# Altium project MidBoard.PrjPCB
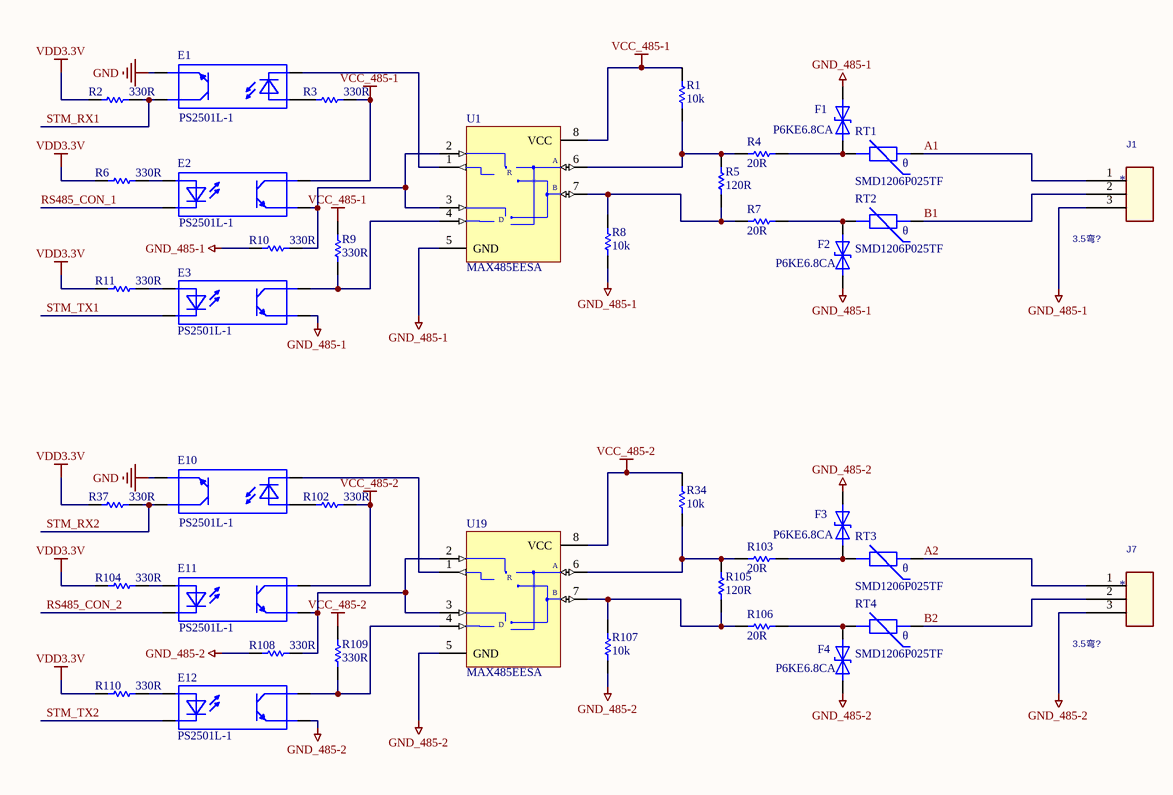
[diagram p0: Mid485.SchDoc]
10 sheets, 315 parts. Net scope: global (net labels, ports and power ports of the same name join across sheets).
Board file: MidBoard.PcbDoc
Sheets:
  Mid485.SchDoc
  MidAdc.SchDoc
  MidDac.SchDoc
  MidDin.SchDoc
  MidDout.SchDoc
  MidPower.SchDoc
  STM_MCU.SchDoc
  MidEthernet.SchDoc
  MidPwm.SchDoc
  MidWifi.SchDoc

## Sheet Mid485.SchDoc
size A4

### Parts
E1  PS2501L-1  [NEC2501]
E2  PS2501L-1  [NEC2501]
E3  PS2501L-1  [NEC2501]
E10  PS2501L-1  [NEC2501]
E11  PS2501L-1  [NEC2501]
E12  PS2501L-1  [NEC2501]
F1  P6KE6.8CA  [P6KE6,8CA]
F2  P6KE6.8CA  [P6KE6,8CA]
F3  P6KE6.8CA  [P6KE6,8CA]
F4  P6KE6.8CA  [P6KE6,8CA]
J1  *  [3.5-P3]
J7  *  [3.5-P3]
R1  value 10k  [0805]  (hidden comment: Res Semi)
R2  value 330R  [0805]  (hidden comment: Res Semi)
R3  value 330R  [0805]  (hidden comment: Res Semi)
R4  value 20R  [0805]  (hidden comment: Res Semi)
R5  value 120R  [0805]  (hidden comment: Res Semi)
R6  value 330R  [0805]  (hidden comment: Res Semi)
R7  value 20R  [0805]  (hidden comment: Res Semi)
R8  value 10k  [0805]  (hidden comment: Res Semi)
R9  value 330R  [0805]  (hidden comment: Res Semi)
R10  value 330R  [0805]  (hidden comment: Res Semi)
R11  value 330R  [0805]  (hidden comment: Res Semi)
R34  value 10k  [0805]  (hidden comment: Res Semi)
R37  value 330R  [0805]  (hidden comment: Res Semi)
R102  value 330R  [0805]  (hidden comment: Res Semi)
R103  value 20R  [0805]  (hidden comment: Res Semi)
R104  value 330R  [0805]  (hidden comment: Res Semi)
R105  value 120R  [0805]  (hidden comment: Res Semi)
R106  value 20R  [0805]  (hidden comment: Res Semi)
R107  value 10k  [0805]  (hidden comment: Res Semi)
R108  value 330R  [0805]  (hidden comment: Res Semi)
R109  value 330R  [0805]  (hidden comment: Res Semi)
R110  value 330R  [0805]  (hidden comment: Res Semi)
RT1  SMD1206P025TF  [1206]
RT2  SMD1206P025TF  [1206]
RT3  SMD1206P025TF  [1206]
RT4  SMD1206P025TF  [1206]
U1  MAX485EESA  [NSO8]
U19  MAX485EESA  [NSO8]

### Nets
GND: E1.3 E10.3
GND_485-1: E3.3 F1.1 F2.2 J1.3 R8.2 R10.2 U1.5(GND)
GND_485-2: E12.3 F3.1 F4.2 J7.3 R107.2 R108.2 U19.5(GND)
VCC_485-1: E2.4 R1.1 R3.1 R9.1 U1.8(VCC)
VCC_485-2: E11.4 R34.1 R102.1 R109.1 U19.8(VCC)
VDD3.3V: R2.2 R6.2 R11.2 R37.2 R104.2 R110.2
A1: J1.1 RT1.2
A2: J7.1 RT3.2
B1: J1.2 RT2.2
B2: J7.2 RT4.2
RS485_CON_1: E2.2
RS485_CON_2: E11.2
STM_RX1: E1.4 R2.1
STM_RX2: E10.4 R37.1
STM_TX1: E3.2
STM_TX2: E12.2
NetE1_1: E1.1 R3.2
NetE1_2: E1.2 U1.1(RO)
NetE2_1: E2.1 R6.1
NetE2_3: E2.3 R10.1 U1.2(~{RE}) U1.3(DE)
NetE3_1: E3.1 R11.1
NetE3_4: E3.4 R9.2 U1.4(DI)
NetE10_1: E10.1 R102.2
NetE10_2: E10.2 U19.1(RO)
NetE11_1: E11.1 R104.1
NetE11_3: E11.3 R108.1 U19.2(~{RE}) U19.3(DE)
NetE12_1: E12.1 R110.1
NetE12_4: E12.4 R109.2 U19.4(DI)
NetF1_2: F1.2 R4.2 RT1.1
NetF2_1: F2.1 R7.2 RT2.1
NetF3_2: F3.2 R103.2 RT3.1
NetF4_1: F4.1 R106.2 RT4.1
NetR1_2: R1.2 R4.1 R5.1 U1.6(A)
NetR5_2: R5.2 R7.1 R8.1 U1.7(B)
NetR34_2: R34.2 R103.1 R105.1 U19.6(A)
NetR105_2: R105.2 R106.1 R107.1 U19.7(B)

### Notes on the sheet
- (in symbol CON3) 3.5弯?
- (in symbol MAX485ESA) R; D
- (in symbol PTC) θ

### Library data of the parts
E1-E3 E10-E12 = OPT: 光耦
F1-F4 = TVS: 快速瞬变二极管
J1 J7 = CON3: TOLERANCE: =J65_TOLERANCE
R1-R11 R34 R37 R102-R110 = Res Semi: Semiconductor Resistor; Published: 8-Jun-2000; LatestRevisionDate: 17-Jul-2002; LatestRevisionNote: Re-released for DXP Platform.; PackageReference: AXIAL-0.5; Publisher: Altium Limited
RT1-RT4 = PTC: 热敏电阻
U1 U19 = MAX485ESA: Low-Power, Slew-Rate-Limited RS-485/RS-422 Transceiver; Code - JEDEC: MS-012-AA; Code - IPC: SO8; Published: 16-Jan-2001; Revision: 17-Jul-2002: Re-released for DXP Platform.; Datasheet: Latest Revision: Feb-1996; Package Reference: NSO8; Publisher: Altium Limited

## Sheet MidAdc.SchDoc
size A4
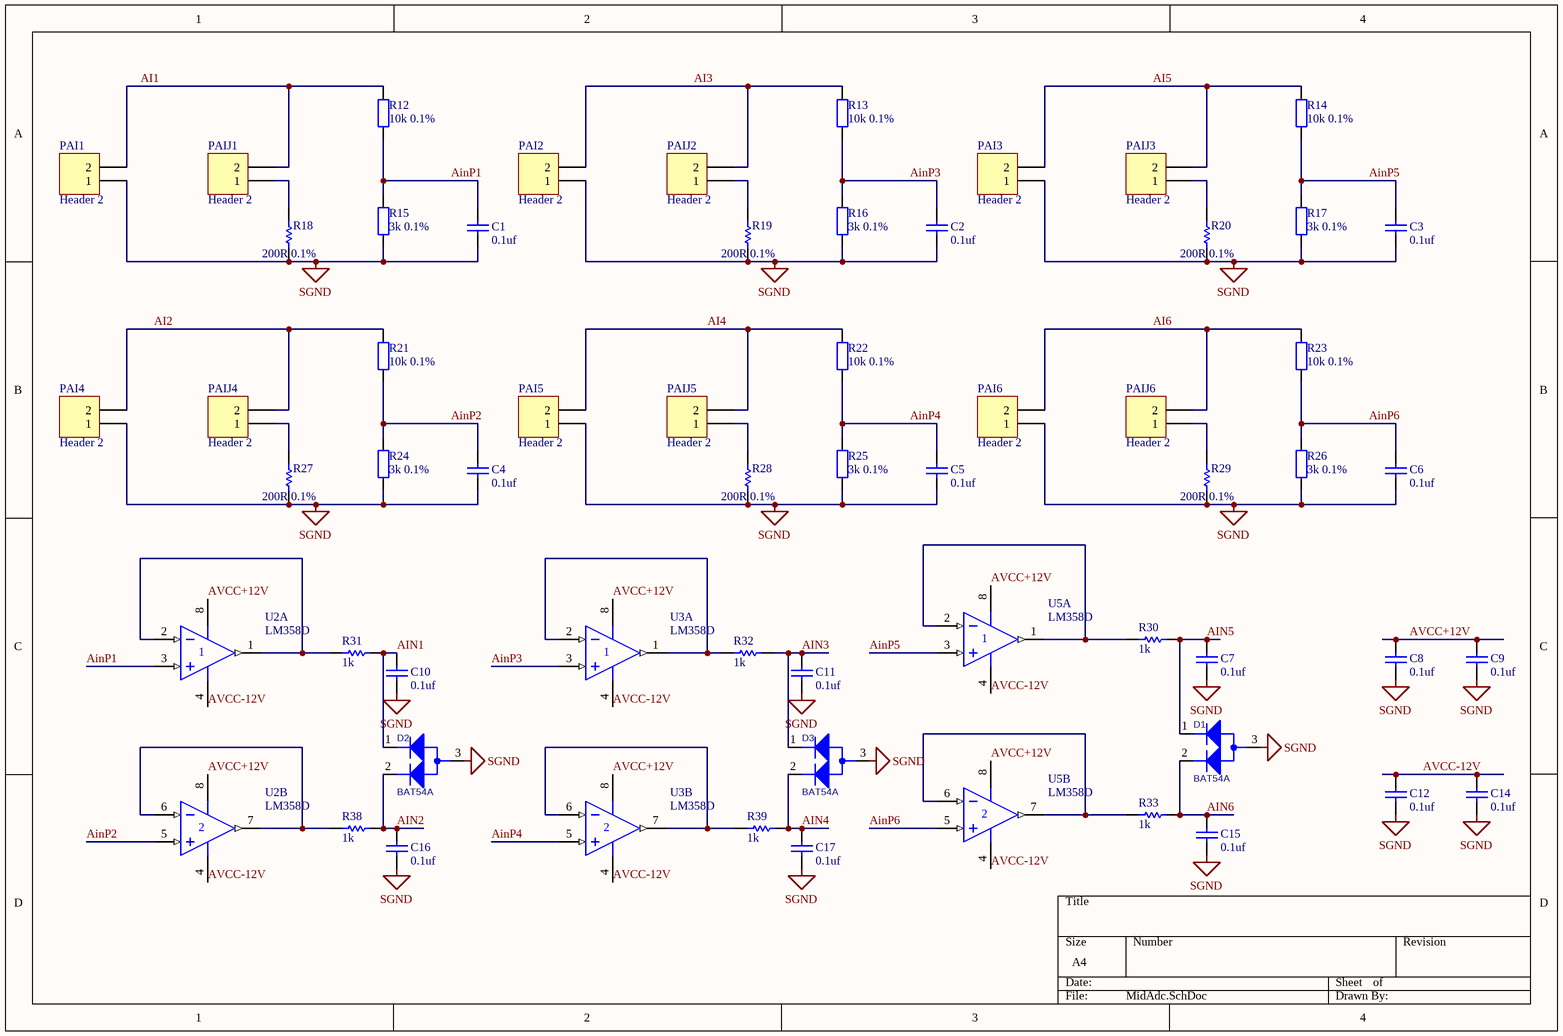
[diagram p1: MidAdc.SchDoc]

### Parts
C1  value 0.1uf  [C0805]  (hidden comment: Cap)
C2  value 0.1uf  [C0805]  (hidden comment: Cap)
C3  value 0.1uf  [C0805]  (hidden comment: Cap)
C4  value 0.1uf  [C0805]  (hidden comment: Cap)
C5  value 0.1uf  [C0805]  (hidden comment: Cap)
C6  value 0.1uf  [C0805]  (hidden comment: Cap)
C7  value 0.1uf  [C0805]  (hidden comment: Cap)
C8  value 0.1uf  [C0805]  (hidden comment: Cap)
C9  value 0.1uf  [C0805]  (hidden comment: Cap)
C10  value 0.1uf  [C0805]  (hidden comment: Cap)
C11  value 0.1uf  [C0805]  (hidden comment: Cap)
C12  value 0.1uf  [C0805]  (hidden comment: Cap)
C14  value 0.1uf  [C0805]  (hidden comment: Cap)
C15  value 0.1uf  [C0805]  (hidden comment: Cap)
C16  value 0.1uf  [C0805]  (hidden comment: Cap)
C17  value 0.1uf  [C0805]  (hidden comment: Cap)
D1  BAT54A  [SOT23]
D2  BAT54A  [SOT23]
D3  BAT54A  [SOT23]
PAI1  Header 2  [3.5-P2]
PAI2  Header 2  [3.5-P2]
PAI3  Header 2  [3.5-P2]
PAI4  Header 2  [3.5-P2]
PAI5  Header 2  [3.5-P2]
PAI6  Header 2  [3.5-P2]
PAIJ1  Header 2  [HDR1X2]
PAIJ2  Header 2  [HDR1X2]
PAIJ3  Header 2  [HDR1X2]
PAIJ4  Header 2  [HDR1X2]
PAIJ5  Header 2  [HDR1X2]
PAIJ6  Header 2  [HDR1X2]
R12  value 10k 0.1%  [0805]  (hidden comment: Res2)
R13  value 10k 0.1%  [0805]  (hidden comment: Res2)
R14  value 10k 0.1%  [0805]  (hidden comment: Res2)
R15  value 3k 0.1%  [0805]  (hidden comment: Res2)
R16  value 3k 0.1%  [0805]  (hidden comment: Res2)
R17  value 3k 0.1%  [0805]  (hidden comment: Res2)
R18  value 200R 0.1%  [0805]  (hidden comment: Res Semi)
R19  value 200R 0.1%  [0805]  (hidden comment: Res Semi)
R20  value 200R 0.1%  [0805]  (hidden comment: Res Semi)
R21  value 10k 0.1%  [0805]  (hidden comment: Res2)
R22  value 10k 0.1%  [0805]  (hidden comment: Res2)
R23  value 10k 0.1%  [0805]  (hidden comment: Res2)
R24  value 3k 0.1%  [0805]  (hidden comment: Res2)
R25  value 3k 0.1%  [0805]  (hidden comment: Res2)
R26  value 3k 0.1%  [0805]  (hidden comment: Res2)
R27  value 200R 0.1%  [0805]  (hidden comment: Res Semi)
R28  value 200R 0.1%  [0805]  (hidden comment: Res Semi)
R29  value 200R 0.1%  [0805]  (hidden comment: Res Semi)
R30  value 1k  [0805]  (hidden comment: Res Semi)
R31  value 1k  [0805]  (hidden comment: Res Semi)
R32  value 1k  [0805]  (hidden comment: Res Semi)
R33  value 1k  [0805]  (hidden comment: Res Semi)
R38  value 1k  [0805]  (hidden comment: Res Semi)
R39  value 1k  [0805]  (hidden comment: Res Semi)
U2  LM358D  [751-02_N]  (parts A,B of 2)
U3  LM358D  [751-02_N]  (parts A,B of 2)
U5  LM358D  [751-02_N]  (parts A,B of 2)

### Nets
SGND: C1.2 C2.2 C3.2 C4.2 C5.2 C6.2 C7.2 C8.2 C9.2 C10.2 C11.2 C12.2 C14.2 C15.2 C16.2 C17.2 D1.3 D2.3 D3.3 PAI1.1 PAI2.1 PAI3.1 PAI4.1 PAI5.1 PAI6.1 R15.2 R16.2 R17.2 R18.2 R19.2 R20.2 R24.2 R25.2 R26.2 R27.2 R28.2 R29.2  [project net ASSA]
AI1: PAI1.2 PAIJ1.2 R12.1
AI2: PAI4.2 PAIJ4.2 R21.1
AI3: PAI2.2 PAIJ2.2 R13.1
AI4: PAI5.2 PAIJ5.2 R22.1
AI5: PAI3.2 PAIJ3.2 R14.1
AI6: PAI6.2 PAIJ6.2 R23.1
AIN1: C10.1 D2.1 R31.2
AIN2: C16.1 D2.2 R38.2
AIN3: C11.1 D3.1 R32.2
AIN4: C17.1 D3.2 R39.2
AIN5: C7.1 D1.1 R30.2
AIN6: C15.1 D1.2 R33.2
AinP1: C1.1 R12.2 R15.1 U2.3(IN+)
AinP2: C4.1 R21.2 R24.1 U2.5(IN+)
AinP3: C2.1 R13.2 R16.1 U3.3(IN+)
AinP4: C5.1 R22.2 R25.1 U3.5(IN+)
AinP5: C3.1 R14.2 R17.1 U5.3(IN+)
AinP6: C6.1 R23.2 R26.1 U5.5(IN+)
AVCC+12V: C8.1 C9.1 U2.8(V+) U3.8(V+) U5.8(V+)
AVCC-12V: C12.1 C14.1 U2.4(V-) U3.4(V-) U5.4(V-)
NetPAIJ1_1: PAIJ1.1 R18.1
NetPAIJ2_1: PAIJ2.1 R19.1
NetPAIJ3_1: PAIJ3.1 R20.1
NetPAIJ4_1: PAIJ4.1 R27.1
NetPAIJ5_1: PAIJ5.1 R28.1
NetPAIJ6_1: PAIJ6.1 R29.1
NetR30_1: R30.1 U5.1(OUT) U5.2(IN-)
NetR31_1: R31.1 U2.1(OUT) U2.2(IN-)
NetR32_1: R32.1 U3.1(OUT) U3.2(IN-)
NetR33_1: R33.1 U5.6(IN-) U5.7(OUT)
NetR38_1: R38.1 U2.6(IN-) U2.7(OUT)
NetR39_1: R39.1 U3.6(IN-) U3.7(OUT)

### Library data of the parts
C1-C12 C14-C17 = Cap: Capacitor; Manufacturer: Generic Components; Class: Passive; Published: 08/06/2000; Publisher: Altium Hobart Technology Centre; SubClass: Capacitor
D1-D3 = BAT54A/SOT_2: PCB Footprint SMD: SMD; SMT: Y; TOLERANCE: =D22_TOLERANCE
PAI1-PAI6 PAIJ1-PAIJ6 = Header 2: Header, 2-Pin; LatestRevisionDate: 17-Jul-2002; LatestRevisionNote: Re-released for DXP Platform.; Publisher: Altium Limited
R12-R17 R21-R26 = RES
R18-R20 R27-R33 R38 R39 = Res Semi: Semiconductor Resistor; Published: 8-Jun-2000; LatestRevisionDate: 17-Jul-2002; LatestRevisionNote: Re-released for DXP Platform.; PackageReference: AXIAL-0.5; Publisher: Altium Limited
U2 U3 U5 = LM358D: Dual Low-Power Operational Amplifier; Published: 17-Jul-2002; LatestRevisionDate: 13-Apr-2006; LatestRevisionNote: IPC-7351 Footprint Added.; DatasheetVersion: 1988; PackageReference: 751-02; Publisher: Altium Limited; PackageDescription: 8-Pin Small Outline Integrated Circuit 1.27 mm Pitch; Code_JEDEC: MS-012-AA; Code_IPC: SOIC127P600-8; ComponentLink1Description: Manufacturer Link; ComponentLink1URL: http://www.onsemi.com/site/products/parametrics/0,4446,251,00.html; ComponentLink2Description: Datasheet; ComponentLink2URL: http://www.onsemi.com/pub/Collateral/LM358-D.PDF

## Sheet MidDac.SchDoc
size A3
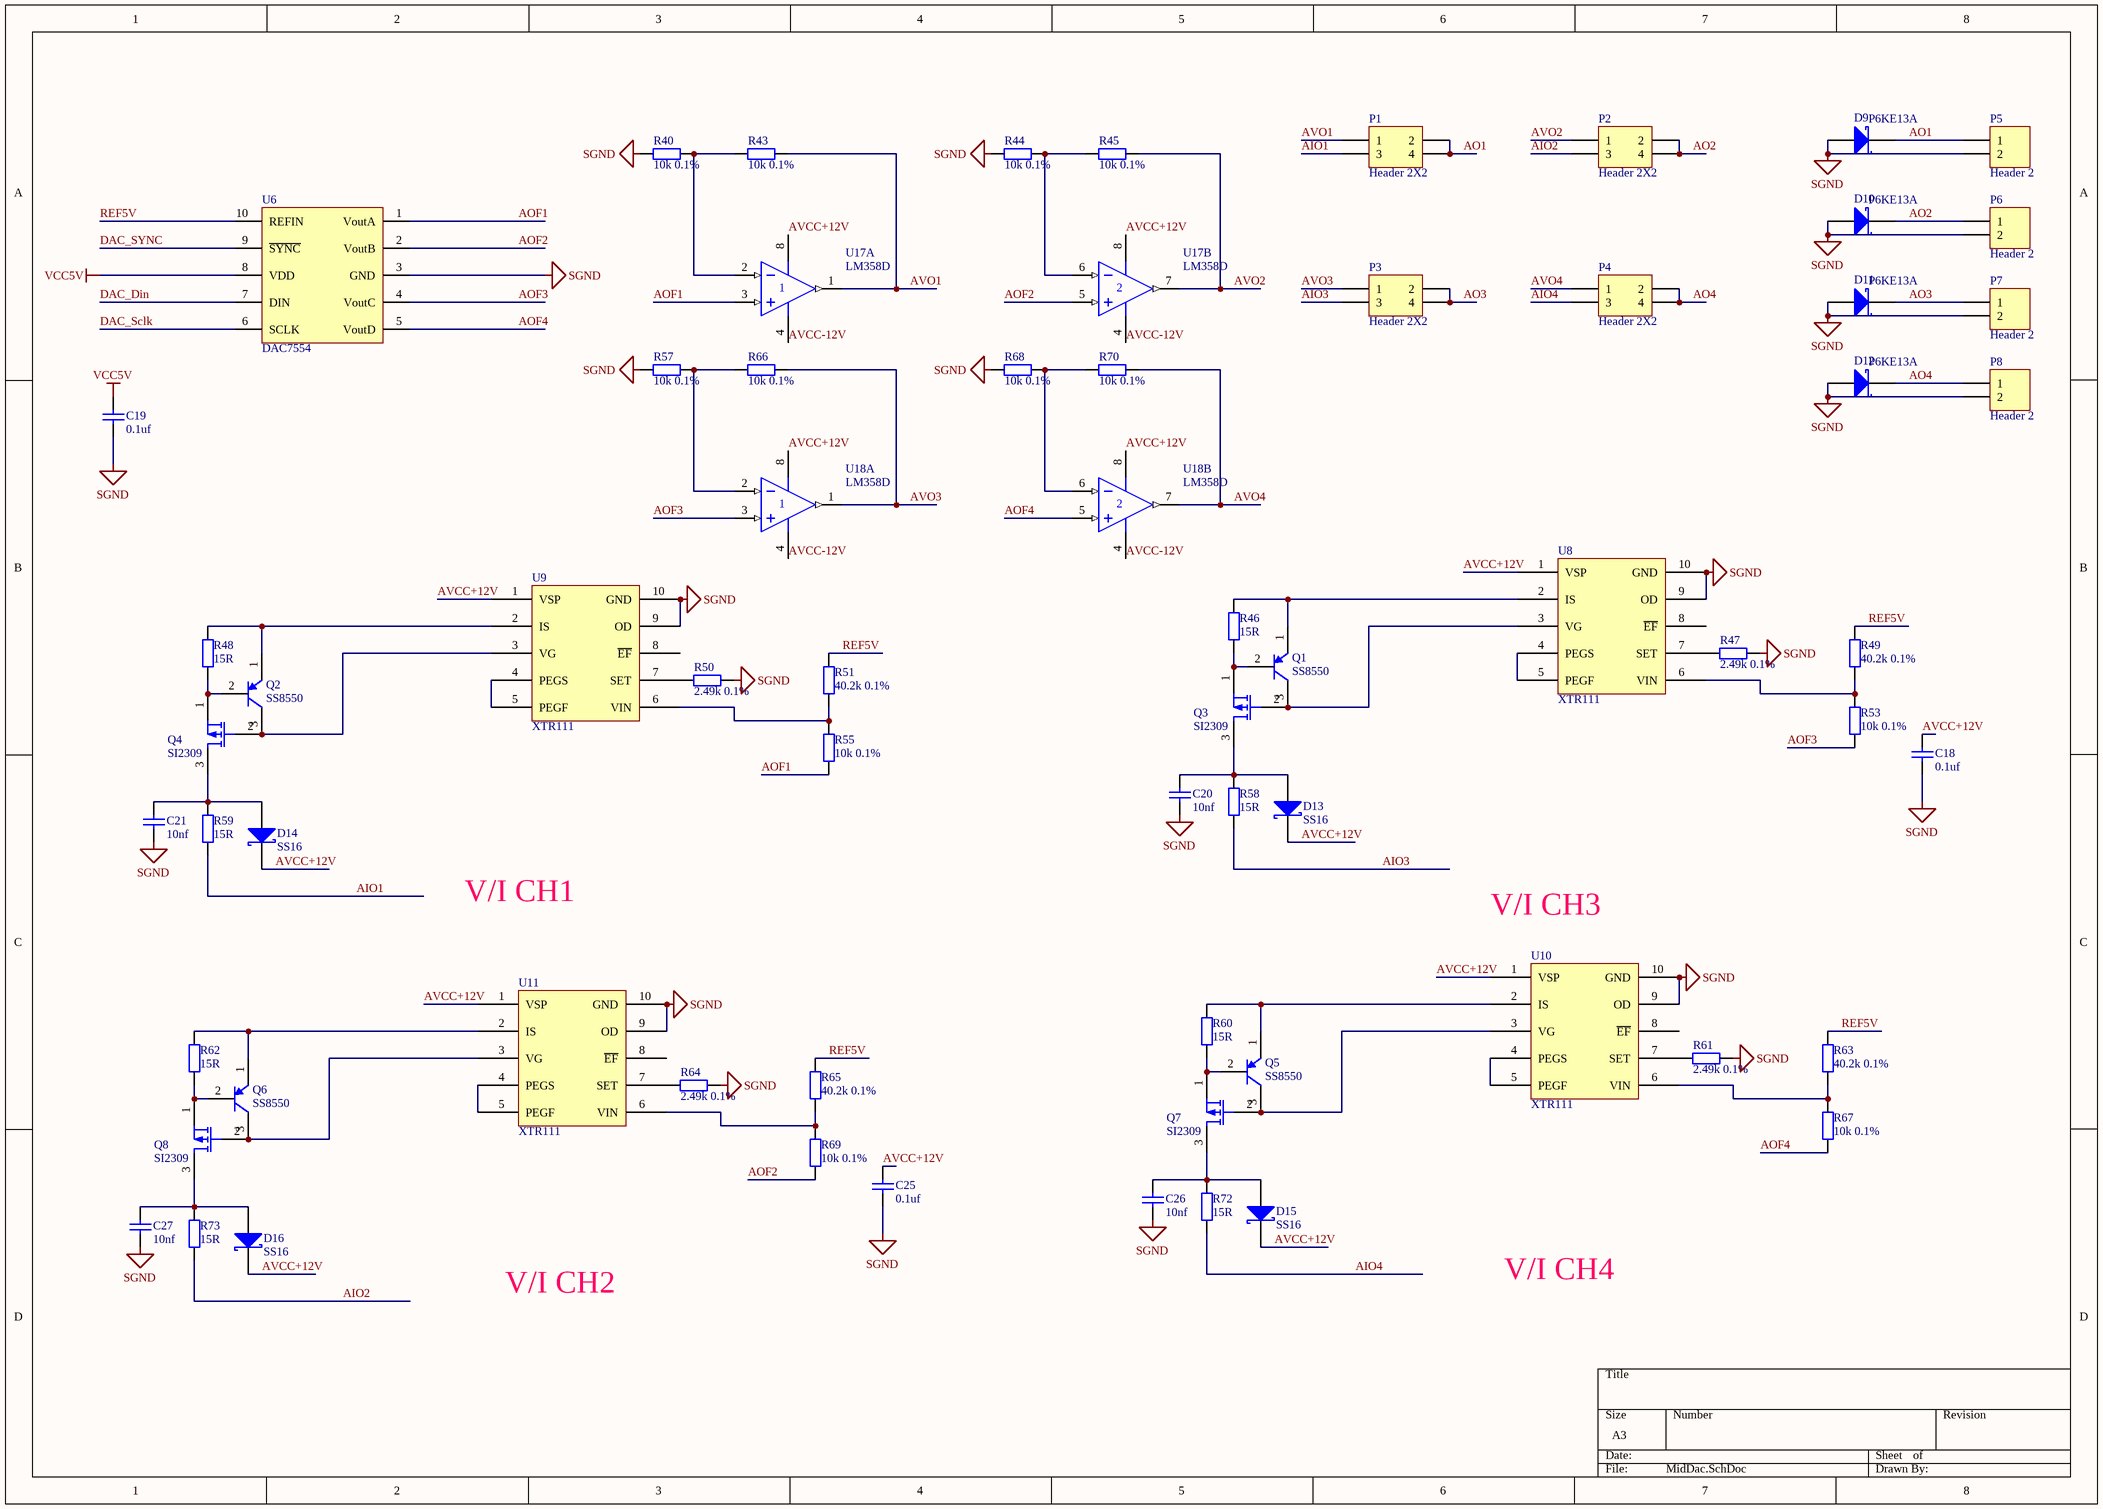
[diagram p2: MidDac.SchDoc]

### Parts
C18  value 0.1uf  [C0805]  (hidden comment: Cap)
C19  value 0.1uf  [C0805]  (hidden comment: Cap)
C20  value 10nf  [C0805]  (hidden comment: Cap)
C21  value 10nf  [C0805]  (hidden comment: Cap)
C25  value 0.1uf  [C0805]  (hidden comment: Cap)
C26  value 10nf  [C0805]  (hidden comment: Cap)
C27  value 10nf  [C0805]  (hidden comment: Cap)
D9  P6KE13A  [SMB]
D10  P6KE13A  [SMB]
D11  P6KE13A  [SMB]
D12  P6KE13A  [SMB]
D13  SS16  [SMB]
D14  SS16  [SMB]
D15  SS16  [SMB]
D16  SS16  [SMB]
P1  Header 2X2  [HDR2X2]
P2  Header 2X2  [HDR2X2]
P3  Header 2X2  [HDR2X2]
P4  Header 2X2  [HDR2X2]
P5  Header 2  [3.5-P2]
P6  Header 2  [3.5-P2]
P7  Header 2  [3.5-P2]
P8  Header 2  [3.5-P2]
Q1  SS8550  [sot-23]
Q2  SS8550  [sot-23]
Q3  SI2309  [sot-23]
Q4  SI2309  [sot-23]
Q5  SS8550  [sot-23]
Q6  SS8550  [sot-23]
Q7  SI2309  [sot-23]
Q8  SI2309  [sot-23]
R40  value 10k 0.1%  [0805]  (hidden comment: Res2)
R43  value 10k 0.1%  [0805]  (hidden comment: Res2)
R44  value 10k 0.1%  [0805]  (hidden comment: Res2)
R45  value 10k 0.1%  [0805]  (hidden comment: Res2)
R46  value 15R  [0805]  (hidden comment: Res2)
R47  value 2.49k 0.1%  [0805]  (hidden comment: Res2)
R48  value 15R  [0805]  (hidden comment: Res2)
R49  value 40.2k 0.1%  [0805]  (hidden comment: Res2)
R50  value 2.49k 0.1%  [0805]  (hidden comment: Res2)
R51  value 40.2k 0.1%  [0805]  (hidden comment: Res2)
R53  value 10k 0.1%  [0805]  (hidden comment: Res2)
R55  value 10k 0.1%  [0805]  (hidden comment: Res2)
R57  value 10k 0.1%  [0805]  (hidden comment: Res2)
R58  value 15R  [0805]  (hidden comment: Res2)
R59  value 15R  [0805]  (hidden comment: Res2)
R60  value 15R  [0805]  (hidden comment: Res2)
R61  value 2.49k 0.1%  [0805]  (hidden comment: Res2)
R62  value 15R  [0805]  (hidden comment: Res2)
R63  value 40.2k 0.1%  [0805]  (hidden comment: Res2)
R64  value 2.49k 0.1%  [0805]  (hidden comment: Res2)
R65  value 40.2k 0.1%  [0805]  (hidden comment: Res2)
R66  value 10k 0.1%  [0805]  (hidden comment: Res2)
R67  value 10k 0.1%  [0805]  (hidden comment: Res2)
R68  value 10k 0.1%  [0805]  (hidden comment: Res2)
R69  value 10k 0.1%  [0805]  (hidden comment: Res2)
R70  value 10k 0.1%  [0805]  (hidden comment: Res2)
R72  value 15R  [0805]  (hidden comment: Res2)
R73  value 15R  [0805]  (hidden comment: Res2)
U6  DAC7554  [VSSOP10]
U8  XTR111  [TSSOP-10_P]
U9  XTR111  [TSSOP-10_P]
U10  XTR111  [TSSOP-10_P]
U11  XTR111  [TSSOP-10_P]
U17  LM358D  [751-02_N]  (parts A,B of 2)
U18  LM358D  [751-02_N]  (parts A,B of 2)

### Nets
SGND: C18.2 C19.2 C20.2 C21.2 C25.2 C26.2 C27.2 D9.1(A) D10.1(A) D11.1(A) D12.1(A) P5.2 P6.2 P7.2 P8.2 R40.1 R44.1 R47.2 R50.2 R57.1 R61.2 R64.2 R68.1 U6.3(GND) U8.9(OD) U8.10(GND) U9.9(OD) U9.10(GND) U10.9(OD) U10.10(GND) U11.9(OD) U11.10(GND)  [project net ASSA]
VCC5V: C19.1 U6.8(VDD)
AIO1: P1.3 R59.2
AIO2: P2.3 R73.2
AIO3: P3.3 R58.2
AIO4: P4.3 R72.2
AO1: D9.2(K) P1.2 P1.4 P5.1
AO2: D10.2(K) P2.2 P2.4 P6.1
AO3: D11.2(K) P3.2 P3.4 P7.1
AO4: D12.2(K) P4.2 P4.4 P8.1
AOF1: R55.2 U6.1(VoutA) U17.3(IN+)
AOF2: R69.2 U6.2(VoutB) U17.5(IN+)
AOF3: R53.2 U6.4(VoutC) U18.3(IN+)
AOF4: R67.2 U6.5(VoutD) U18.5(IN+)
AVCC+12V: C18.1 C25.1 D13.2(K) D14.2(K) D15.2(K) D16.2(K) U8.1(VSP) U9.1(VSP) U10.1(VSP) U11.1(VSP) U17.8(V+) U18.8(V+)
AVCC-12V: U17.4(V-) U18.4(V-)
AVO1: P1.1 R43.2 U17.1(OUT)
AVO2: P2.1 R45.2 U17.7(OUT)
AVO3: P3.1 R66.2 U18.1(OUT)
AVO4: P4.1 R70.2 U18.7(OUT)
DAC_Din: U6.7(DIN)
DAC_Sclk: U6.6(SCLK)
DAC_SYNC: U6.9(~{SYNC})
REF5V: R49.1 R51.1 R63.1 R65.1 U6.10(REFIN)
NetC20_1: C20.1 D13.1(A) Q3.3(D) R58.1
NetC21_1: C21.1 D14.1(A) Q4.3(D) R59.1
NetC26_1: C26.1 D15.1(A) Q7.3(D) R72.1
NetC27_1: C27.1 D16.1(A) Q8.3(D) R73.1
NetQ1_1: Q1.1(E) R46.1 U8.2(IS)
NetQ1_2: Q1.2(B) Q3.1(S) R46.2
NetQ1_3: Q1.3(C) Q3.2(G) U8.3(VG)
NetQ2_1: Q2.1(E) R48.1 U9.2(IS)
NetQ2_2: Q2.2(B) Q4.1(S) R48.2
NetQ2_3: Q2.3(C) Q4.2(G) U9.3(VG)
NetQ5_1: Q5.1(E) R60.1 U10.2(IS)
NetQ5_2: Q5.2(B) Q7.1(S) R60.2
NetQ5_3: Q5.3(C) Q7.2(G) U10.3(VG)
NetQ6_1: Q6.1(E) R62.1 U11.2(IS)
NetQ6_2: Q6.2(B) Q8.1(S) R62.2
NetQ6_3: Q6.3(C) Q8.2(G) U11.3(VG)
NetR40_2: R40.2 R43.1 U17.2(IN-)
NetR44_2: R44.2 R45.1 U17.6(IN-)
NetR47_1: R47.1 U8.7(SET)
NetR49_2: R49.2 R53.1 U8.6(VIN)
NetR50_1: R50.1 U9.7(SET)
NetR51_2: R51.2 R55.1 U9.6(VIN)
NetR57_2: R57.2 R66.1 U18.2(IN-)
NetR61_1: R61.1 U10.7(SET)
NetR63_2: R63.2 R67.1 U10.6(VIN)
NetR64_1: R64.1 U11.7(SET)
NetR65_2: R65.2 R69.1 U11.6(VIN)
NetR68_2: R68.2 R70.1 U18.6(IN-)
NetU8_4: U8.4(PEGS) U8.5(PEGF)
NetU9_4: U9.4(PEGS) U9.5(PEGF)
NetU10_4: U10.4(PEGS) U10.5(PEGF)
NetU11_4: U11.4(PEGS) U11.5(PEGF)

Not connected (* = marked no-connect by the designer): U8 8(~{EF}); U9 8(~{EF}); U10 8(~{EF}); U11 8(~{EF})

### Notes on the sheet
- V/I CH1
- V/I CH3
- V/I CH2
- V/I CH4

### Library data of the parts
C18-C21 C25-C27 = Cap: as C1 on sheet MidAdc; Published: 08/06/2000; Publisher: Altium Hobart Technology Centre; SubClass: Capacitor
D9-D16 = D Schottky: Schottky Diode; Published: 8-Jun-2000; LatestRevisionDate: 17-Jul-2002; LatestRevisionNote: Re-released for DXP Platform.; PackageReference: SMB; Publisher: Altium Limited; Code_JEDEC: DO-214-AA
P1-P4 = Header 2X2: Header, 2-Pin, Dual row; LatestRevisionDate: 17-Jul-2002; LatestRevisionNote: Re-released for DXP Platform.; Publisher: Altium Limited
P5-P8 = Header 2: Header, 2-Pin; LatestRevisionDate: 17-Jul-2002; LatestRevisionNote: Re-released for DXP Platform.; Publisher: Altium Limited
Q1 Q2 Q5 Q6 = 2N3906: PNP General Purpose Amplifier; Published: 8-Jun-2000; LatestRevisionDate: 15-Jan-2003; LatestRevisionNote: PCB Footprint 'BCY-W3/D4.7' replaced; DatasheetVersion: 1997; PackageVersion: Sep-1998; PackageReference: TO-92A; Publisher: Altium Limited; PackageDescription: TO, Flat Index; 3 In-Line, Axial Leads; Body Dia. 4.5mm; Leads 0.51 x 0.48 mm (max); ComponentLink1Description: Manufacturer Link; ComponentLink1URL: http://www.fairchildsemi.com/; ComponentLink2Description: Datasheet; ComponentLink2URL: http://www.fairchildsemi.com/ds/2N%2F2N3906.pdf
Q3 Q4 Q7 Q8 = MOSFET-P: P-Channel MOSFET; Published: 8-Jun-2000; LatestRevisionDate: 17-Jul-2002; LatestRevisionNote: Re-released for DXP Platform.; PackageVersion: 1995/1996; PackageReference: E3; Publisher: Altium Limited; PackageDescription: TO, Flat Index; 3 In-Line, Axial Leads; Body Dia. 4.6mm; Lead Dia. 0.5 mm (max)
R40 R43-R51 R53 R55 R57-R70 R72 R73 = RES
U8-U11 = XT
U17 U18 = LM358D: Dual Low-Power Operational Amplifier; Published: 17-Jul-2002; LatestRevisionDate: 13-Apr-2006; LatestRevisionNote: IPC-7351 Footprint Added.; DatasheetVersion: 1988; PackageReference: 751-02; Publisher: Altium Limited; PackageDescription: 8-Pin Small Outline Integrated Circuit 1.27 mm Pitch; Code_JEDEC: MS-012-AA; Code_IPC: SOIC127P600-8; ComponentLink1Description: Manufacturer Link; ComponentLink1URL: http://www.onsemi.com/site/products/parametrics/0,4446,251,00.html; ComponentLink2Description: Datasheet; ComponentLink2URL: http://www.onsemi.com/pub/Collateral/LM358-D.PDF

## Sheet MidDin.SchDoc
size A4
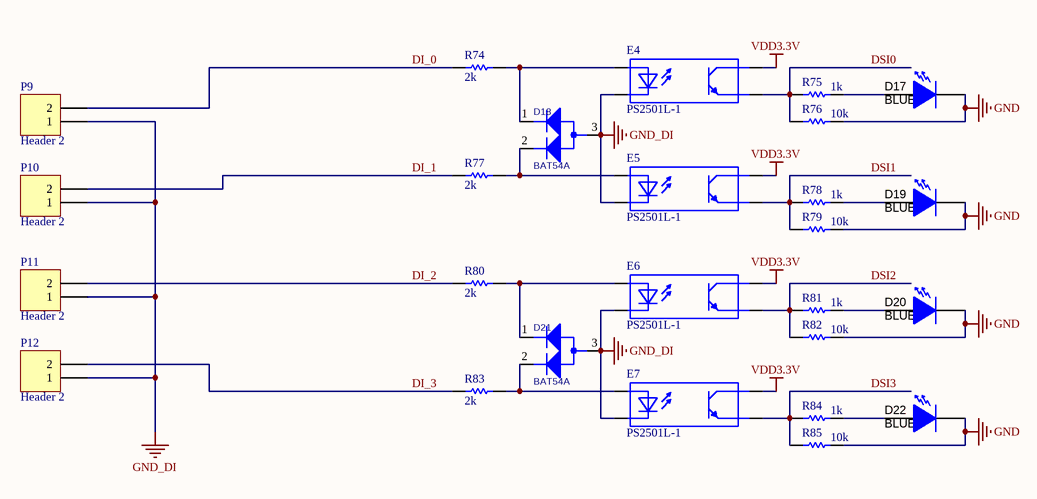
[diagram p3: MidDin.SchDoc]

### Parts
D17  value BLUE  [D0805]  (hidden comment: SML-P12YTT86)
D18  BAT54A  [SOT23]
D19  value BLUE  [D0805]  (hidden comment: SML-P12YTT86)
D20  value BLUE  [D0805]  (hidden comment: SML-P12YTT86)
D21  BAT54A  [SOT23]
D22  value BLUE  [D0805]  (hidden comment: SML-P12YTT86)
E4  PS2501L-1  [NEC2501]
E5  PS2501L-1  [NEC2501]
E6  PS2501L-1  [NEC2501]
E7  PS2501L-1  [NEC2501]
P9  Header 2  [3.5-P2]
P10  Header 2  [3.5-P2]
P11  Header 2  [3.5-P2]
P12  Header 2  [3.5-P2]
R74  value 2k  [0805]  (hidden comment: Res Semi)
R75  value 1k  [0805]  (hidden comment: Res Semi)
R76  value 10k  [0805]  (hidden comment: Res Semi)
R77  value 2k  [0805]  (hidden comment: Res Semi)
R78  value 1k  [0805]  (hidden comment: Res Semi)
R79  value 10k  [0805]  (hidden comment: Res Semi)
R80  value 2k  [0805]  (hidden comment: Res Semi)
R81  value 1k  [0805]  (hidden comment: Res Semi)
R82  value 10k  [0805]  (hidden comment: Res Semi)
R83  value 2k  [0805]  (hidden comment: Res Semi)
R84  value 1k  [0805]  (hidden comment: Res Semi)
R85  value 10k  [0805]  (hidden comment: Res Semi)

### Nets
GND: D17.2(K) D19.2(K) D20.2(K) D22.2(K) R76.2 R79.2 R82.2 R85.2
GND_DI: D18.3 D21.3 E4.2 E5.2 E6.2 E7.2 P9.1 P10.1 P11.1 P12.1
VDD3.3V: E4.4 E5.4 E6.4 E7.4
DI_0: P9.2 R74.1
DI_1: P10.2 R77.1
DI_2: P11.2 R80.1
DI_3: P12.2 R83.1
DSI0: E4.3 R75.1 R76.1
DSI1: E5.3 R78.1 R79.1
DSI2: E6.3 R81.1 R82.1
DSI3: E7.3 R84.1 R85.1
NetD17_1: D17.1(A) R75.2
NetD18_1: D18.1 E4.1 R74.2
NetD18_2: D18.2 E5.1 R77.2
NetD19_1: D19.1(A) R78.2
NetD20_1: D20.1(A) R81.2
NetD21_1: D21.1 E6.1 R80.2
NetD21_2: D21.2 E7.1 R83.2
NetD22_1: D22.1(A) R84.2

### Library data of the parts
D17 D19 D20 D22 = SML-P12YTT86: LED, GREEN SMD; Manufacturer: Rohm; Type: InGaN; Vf_V: 2.1; Value2: 2.1V; Io_A: 0.02; Tjmax_C: 85; Value1: W; Color: yellow; U/M: EA; CompType: LED; PartNumber: SML-P12YTT86; SymbolVersion: 2008-12-08; MountType: SMT; RoHS: Y; PackageReference: Yellow LED; Published: 2008-07-11; Publisher: Texas Instruments; ComponentLink1URL: http://rohmfs.rohm.com/en/products/databook/datasheet/opto/led/chip_mono/sml-p1.pdf; ComponentLink1Description: Datasheet link; LatestRevisionDate: 2013-06-24; LatestRevisionNote: Updated supplier queries; Supplier 1: Digi-Key; Supplier Part Number 1: 511-1595-1-ND; Supplier 2: Mouser; Supplier Part Number 2: 755-SML-P12YTT86; Supplier 3: Farnell; Supplier Part Number 3: 1973107
D18 D21 = BAT54A/SOT_2: PCB Footprint SMD: SMD; SMT: Y; TOLERANCE: =D22_TOLERANCE
E4-E7 = O: 光耦
P9-P12 = Header 2: Header, 2-Pin; LatestRevisionDate: 17-Jul-2002; LatestRevisionNote: Re-released for DXP Platform.; Publisher: Altium Limited
R74-R85 = Res Semi: Semiconductor Resistor; Published: 8-Jun-2000; LatestRevisionDate: 17-Jul-2002; LatestRevisionNote: Re-released for DXP Platform.; PackageReference: AXIAL-0.5; Publisher: Altium Limited

## Sheet MidDout.SchDoc
size A4
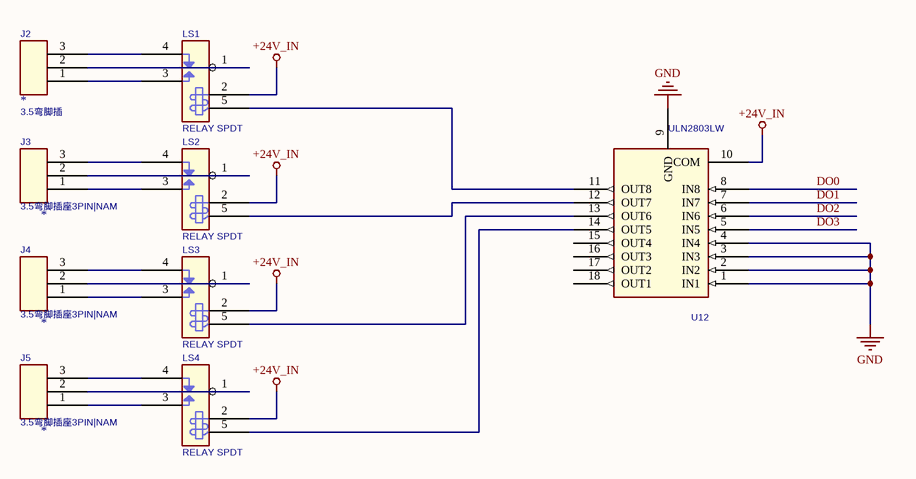
[diagram p4: MidDout.SchDoc]

### Parts
J2  *  [3.5-P3]
J3  *  [3.5-P3]
J4  *  [3.5-P3]
J5  *  [3.5-P3]
LS1  RELAY SPDT  [RELAY_OMRON_G5LE-14]
LS2  RELAY SPDT  [RELAY_OMRON_G5LE-14]
LS3  RELAY SPDT  [RELAY_OMRON_G5LE-14]
LS4  RELAY SPDT  [RELAY_OMRON_G5LE-14]
U12  ULN2803LW  [SO18WN]

### Nets
+24V_IN: LS1.2(COIL2) LS2.2(COIL2) LS3.2(COIL2) LS4.2(COIL2) U12.10(COM)
GND: U12.1(IN1) U12.2(IN2) U12.3(IN3) U12.4(IN4) U12.9(GND)
DO0: U12.8(IN8)
DO1: U12.7(IN7)
DO2: U12.6(IN6)
DO3: U12.5(IN5)
NetJ2_1: J2.1 LS1.3(NO)
NetJ2_2: J2.2 LS1.1(COMMON)
NetJ2_3: J2.3 LS1.4(NC)
NetJ3_1: J3.1 LS2.3(NO)
NetJ3_2: J3.2 LS2.1(COMMON)
NetJ3_3: J3.3 LS2.4(NC)
NetJ4_1: J4.1 LS3.3(NO)
NetJ4_2: J4.2 LS3.1(COMMON)
NetJ4_3: J4.3 LS3.4(NC)
NetJ5_1: J5.1 LS4.3(NO)
NetJ5_2: J5.2 LS4.1(COMMON)
NetJ5_3: J5.3 LS4.4(NC)
NetLS1_5: LS1.5(COIL1) U12.11(OUT8)
NetLS2_5: LS2.5(COIL1) U12.12(OUT7)
NetLS3_5: LS3.5(COIL1) U12.13(OUT6)
NetLS4_5: LS4.5(COIL1) U12.14(OUT5)

Not connected (* = marked no-connect by the designer): U12 15(OUT4) 16(OUT3) 17(OUT2) 18(OUT1)

### Notes on the sheet
- (in symbol CON3) 3.5弯脚插; 3.5弯脚插座3PIN|NAM

### Library data of the parts
J2-J5 = CON3: PCB Footprint SMD: 插件; TOLERANCE: =J57_TOLERANCE
LS1-LS4 = RELAY SPDT_1
U12 = ULN2803: PCB Footprint SMD: SMD; TOLERANCE: =U21_TOLERANCE

## Sheet MidPower.SchDoc
size A4
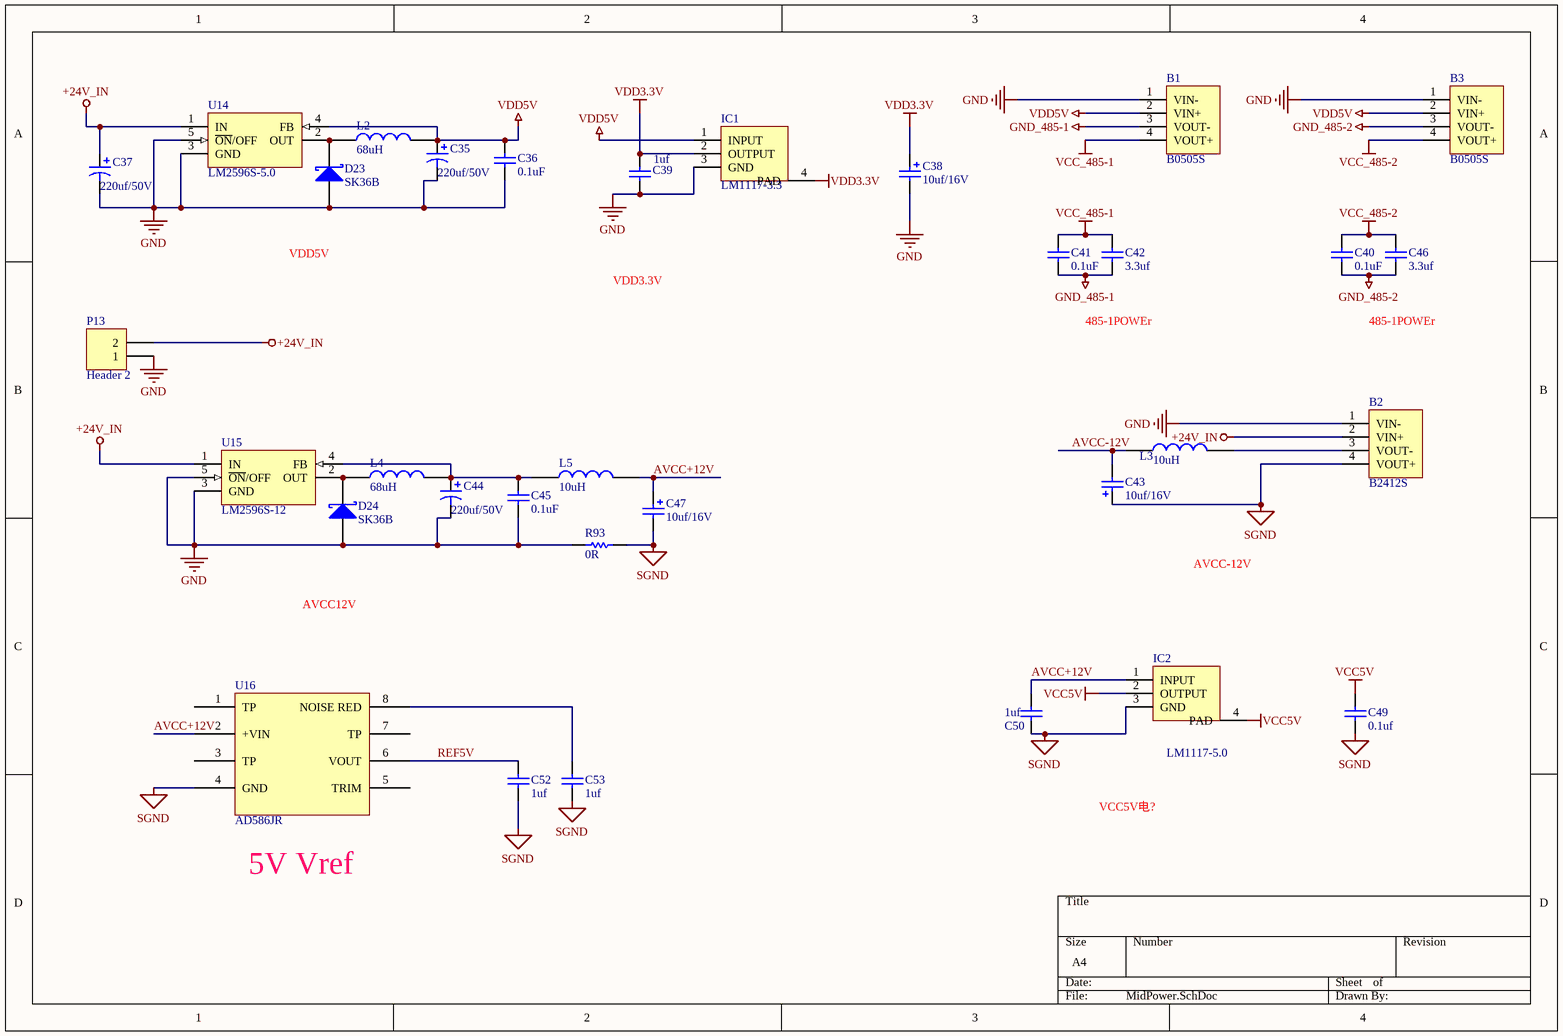
[diagram p5: MidPower.SchDoc]

### Parts
B1  B0505S  [B0505S]
B2  B2412S  [B0505S]
B3  B0505S  [B0505S]
C35  value 220uf/50V  [Cap5*10*12]  (hidden comment: Cap Pol1)
C36  value 0.1uF  [C0805]  (hidden comment: Cap)
C37  value 220uf/50V  [Cap5*10*12]  (hidden comment: Cap Pol1)
C38  value 10uf/16V  [C3216]
C39  value 1uf  [C0805]  (hidden comment: Cap)
C40  value 0.1uF  [C0805]  (hidden comment: Cap)
C41  value 0.1uF  [C0805]  (hidden comment: Cap)
C42  value 3.3uf  [C0805]  (hidden comment: Cap)
C43  value 10uf/16V  [C3216]
C44  value 220uf/50V  [Cap5*10*12]  (hidden comment: Cap Pol1)
C45  value 0.1uF  [C0805]  (hidden comment: Cap)
C46  value 3.3uf  [C0805]  (hidden comment: Cap)
C47  value 10uf/16V  [C3216]
C49  value 0.1uf  [C0805]  (hidden comment: Cap)
C50  value 1uf  [C0805]  (hidden comment: Cap)
C52  value 1uf  [C0805]  (hidden comment: Cap)
C53  value 1uf  [C0805]  (hidden comment: Cap)
D23  SK36B  [SMB]
D24  SK36B  [SMB]
IC1  LM1117-3.3  [LM1117]
IC2  LM1117-5.0  [LM1117]
L2  68uH  [IND_HM00_12*12]
L3  10uH  [INDM4532N]
L4  68uH  [IND_HM00_12*12]
L5  10uH  [INDM4532N]
P13  Header 2  [3.5-P2]
R93  value 0R  [0805]  (hidden comment: Res Semi)
U14  LM2596S-5.0  [TS5B_M]
U15  LM2596S-12  [TS5B_M]
U16  AD586JR  [SOP8_M]

### Nets
+24V_IN: B2.2(VIN+) C37.1 P13.2 U14.1(IN) U15.1(IN)
GND: B1.1(VIN-) B2.1(VIN-) B3.1(VIN-) C35.2 C36.1 C37.2 C38.2 C39.2 C44.2 C45.1 D23.1(A) D24.1(A) IC1.3(GND) P13.1 R93.2 U14.3(GND) U14.5(~{ON}/OFF) U15.3(GND) U15.5(~{ON}/OFF)
GND_485-1: B1.3(VOUT-) C41.1 C42.1
GND_485-2: B3.3(VOUT-) C40.1 C46.1
SGND: B2.4(VOUT+) C43.1 C47.2 C49.2 C50.2 C52.2 C53.2 IC2.3(GND) R93.1 U16.4(GND)  [project net ASSA]
VCC5V: C49.1 IC2.2(OUTPUT) IC2.4(PAD)
VCC_485-1: B1.4(VOUT+) C41.2 C42.2
VCC_485-2: B3.4(VOUT+) C40.2 C46.2
VDD3.3V: C38.1 C39.1 IC1.2(OUTPUT) IC1.4(PAD)
VDD5V: B1.2(VIN+) B3.2(VIN+) C35.1 C36.2 IC1.1(INPUT) L2.2 U14.4(FB)
AVCC+12V: C47.1 C50.1 IC2.1(INPUT) L5.2 U16.2(+VIN)
AVCC-12V: C43.2 L3.1
REF5V: C52.1 U16.6(VOUT)
NetB2_3: B2.3(VOUT-) L3.2
NetC44_1: C44.1 C45.2 L4.2 L5.1 U15.4(FB)
NetC53_1: C53.1 U16.8(NOISE_RED)
NetD23_2: D23.2(K) L2.1 U14.2(OUT)
NetD24_2: D24.2(K) L4.1 U15.2(OUT)

Not connected (* = marked no-connect by the designer): U16 1(TP) 3(TP) 5(TRIM) 7(TP)

### Notes on the sheet
- VDD5V
- VDD3.3V
- 485-1POWEr
- AVCC-12V
- AVCC12V
- VCC5V电?
- 5V Vref

### Library data of the parts
B2 = B0505S
C35 C37 C44 = Cap Pol1: Polarized Capacitor (Radial); Published: 8-Jun-2000; LatestRevisionDate: 17-Jul-2002; LatestRevisionNote: Re-released for DXP Platform.; PackageReference: RB7.6-15; Publisher: Altium Limited
C36 C40-C42 C45 C46 = Cap_2: Capacitor; Published: 8-Jun-2000; LatestRevisionDate: 17-Jul-2002; LatestRevisionNote: Re-released for DXP Platform.; Publisher: Altium Limited
C38 C43 C47 = Cap Pol2: Polarized Capacitor (Axial); Published: 8-Jun-2000; LatestRevisionDate: 17-Jul-2002; LatestRevisionNote: Re-released for DXP Platform.; PackageReference: POLAR0.8; Publisher: Altium Limited; PackageDescription: Polarized Capacitor; 2 Leads
C39 C49 C50 C52 C53 = Cap: as C1 on sheet MidAdc; Published: 08/06/2000; Publisher: Altium Hobart Technology Centre; SubClass: Capacitor
D23 D24 = D Schottky: Schottky Diode; Published: 8-Jun-2000; LatestRevisionDate: 17-Jul-2002; LatestRevisionNote: Re-released for DXP Platform.; PackageReference: SMB; Publisher: Altium Limited; Code_JEDEC: DO-214-AA
IC1 IC2 = LM1117
L2-L5 = INDUCTOR
P13 = Header 2: Header, 2-Pin; LatestRevisionDate: 17-Jul-2002; LatestRevisionNote: Re-released for DXP Platform.; Publisher: Altium Limited
R93 = Res Semi: Semiconductor Resistor; Published: 8-Jun-2000; LatestRevisionDate: 17-Jul-2002; LatestRevisionNote: Re-released for DXP Platform.; PackageReference: AXIAL-0.5; Publisher: Altium Limited
U14 = LM2596S-5.0: Simple Switcher Power Converter 150 kHz 3A Step Down Voltage Regulator; Note: Tab is connected to GND; Published: 15-Apr-2002; DatasheetVersion: Dec-1997; PackageReference: TS5B; Publisher: Altium Limited; PackageDescription: D2-PAK; 5 Leads; Body 14.4 (inc. leads) x 10.4 mm (LxW max); ComponentLink1Description: Manufacturer Link; ComponentLink1URL: http://www.national.com/; ComponentLink2Description: Datasheet; ComponentLink2URL: http://www.national.com/ds.cgi/LM/LM2596.pdf; ComponentLink3Description: URL Link1; ComponentLink3URL: http://www.national.com/pf/LM/LM2596.html
U15 = LM2596S-12: Simple Switcher Power Converter 150 kHz 3A Step Down Voltage Regulator; Note: Tab is connected to GND; Published: 15-Apr-2002; DatasheetVersion: Dec-1997; PackageReference: TS5B; Publisher: Altium Limited; PackageDescription: D2-PAK; 5 Leads; Body 14.4 (inc. leads) x 10.4 mm (LxW max); ComponentLink1Description: Manufacturer Link; ComponentLink1URL: http://www.national.com/; ComponentLink2Description: Datasheet; ComponentLink2URL: http://www.national.com/ds.cgi/LM/LM2596.pdf; ComponentLink3Description: URL Link1; ComponentLink3URL: http://www.national.com/pf/LM/LM2596.html
U16 = AD586L

## Sheet STM_MCU.SchDoc
size A4
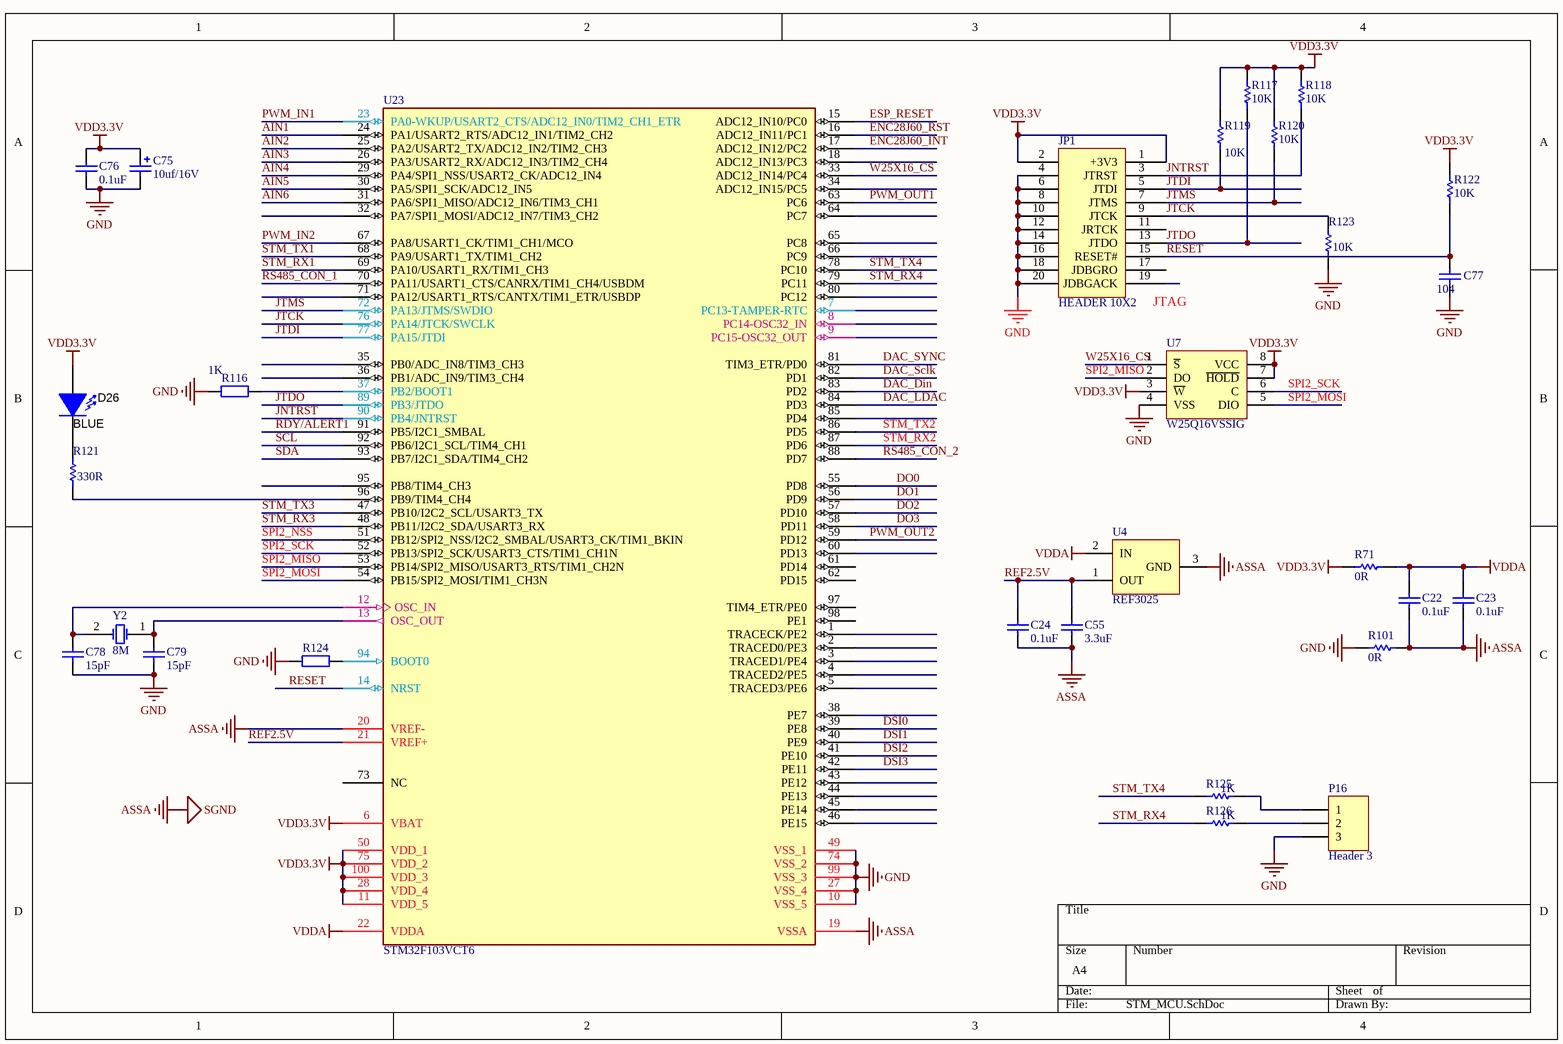
[diagram p6: STM_MCU.SchDoc]

### Parts
C22  value 0.1uF  [C0805]  (hidden comment: Cap)
C23  value 0.1uF  [C0805]  (hidden comment: Cap)
C24  0.1uF  [C0805]
C55  3.3uF  [C0805]
C75  value 10uf/16V  [C3216]
C76  value 0.1uF  [C0805]  (hidden comment: Cap)
C77  104  [C0805]
C78  value 15pF  [C0805]  (hidden comment: Cap)
C79  value 15pF  [C0805]  (hidden comment: Cap)
D26  value BLUE  [D0805]  (hidden comment: SML-P12YTT86)
JP1  HEADER 10X2  [STM32-JLINK]
P16  Header 3  [HDR1X3]
R71  value 0R  [0805]  (hidden comment: Res Semi)
R101  value 0R  [0805]  (hidden comment: Res Semi)
R116  value 1K  [0805]  (hidden comment: Res2)
R117  value 10K  [0805]  (hidden comment: Res Semi)
R118  value 10K  [0805]  (hidden comment: Res Semi)
R119  value 10K  [0805]  (hidden comment: Res Semi)
R120  value 10K  [0805]  (hidden comment: Res Semi)
R121  value 330R  [0805]  (hidden comment: Res Semi)
R122  10K  [0805]
R123  value 10K  [0805]  (hidden comment: Res Semi)
R124  Res2  [0805]  (value not drawn)
R125  value 1K  [0805]  (hidden comment: Res1)
R126  value 1K  [0805]  (hidden comment: Res1)
U4  REF3025  [SOT-23]
U7  W25Q16VSSIG  [wsop8]
U23  STM32F103VCT6  [LQFP100_M]
Y2  XTAL  [CY]  (value not drawn)

### Nets
ASSA: C22.1 C23.1 C24.1 C55.1 R101.2 U4.3(GND) U23.19(VSSA) U23.20(VREF-)  [also labelled SGND]
GND: C75.2 C76.1 C77.1 C78.1 C79.1 JP1.4 JP1.6 JP1.8 JP1.10 JP1.12 JP1.14 JP1.16 JP1.18 JP1.20 P16.3 R101.1 R116.1 R123.1 R124.1 U7.4(VSS) U23.10(VSS_5) U23.27(VSS_4) U23.49(VSS_1) U23.74(VSS_2) U23.99(VSS_3)
VDD3.3V: C75.1 C76.2 D26.1(A) JP1.1(+3V3) JP1.2 R71.1 R117.2 R118.2 R119.2 R120.2 R122.2 U7.3(~{W}) U7.7(~{HOLD}) U7.8(VCC) U23.6(VBAT) U23.11(VDD_5) U23.28(VDD_4) U23.50(VDD_1) U23.75(VDD_2) U23.100(VDD_3)
VDDA: C22.2 C23.2 R71.2 U4.2(IN) U23.22(VDDA)
AIN1: U23.24(PA1/USART2_RTS/ADC12_IN1/TIM2_CH2)
AIN2: U23.25(PA2/USART2_TX/ADC12_IN2/TIM2_CH3)
AIN3: U23.26(PA3/USART2_RX/ADC12_IN3/TIM2_CH4)
AIN4: U23.29(PA4/SPI1_NSS/USART2_CK/ADC12_IN4)
AIN5: U23.30(PA5/SPI1_SCK/ADC12_IN5)
AIN6: U23.31(PA6/SPI1_MISO/ADC12_IN6/TIM3_CH1)
DAC_Din: U23.83(PD2)
DAC_LDAC: U23.84(PD3)
DAC_Sclk: U23.82(PD1)
DAC_SYNC: U23.81(TIM3_ETR/PD0)
DO0: U23.55(PD8)
DO1: U23.56(PD9)
DO2: U23.57(PD10)
DO3: U23.58(PD11)
DSI0: U23.39(PE8)
DSI1: U23.40(PE9)
DSI2: U23.41(PE10)
DSI3: U23.42(PE11)
ENC28J60_INT: U23.17(ADC12_IN12/PC2)
ENC28J60_RST: U23.16(ADC12_IN11/PC1)
ESP_RESET: U23.15(ADC12_IN10/PC0)
JNTRST: JP1.3(JTRST) R118.1 U23.90(PB4/JNTRST)
JTCK: JP1.9(JTCK) R123.2 U23.76(PA14/JTCK/SWCLK)
JTDI: JP1.5(JTDI) R119.1 U23.77(PA15/JTDI)
JTDO: JP1.13(JTDO) R117.1 U23.89(PB3/JTDO)
JTMS: JP1.7(JTMS) R120.1 U23.72(PA13/JTMS/SWDIO)
PWM_IN1: U23.23(PA0-WKUP/USART2_CTS/ADC12_IN0/TIM2_CH1_ETR)
PWM_IN2: U23.67(PA8/USART1_CK/TIM1_CH1/MCO)
PWM_OUT1: U23.63(PC6)
PWM_OUT2: U23.59(PD12)
RDY/ALERT1: U23.91(PB5/I2C1_SMBAL)
REF2.5V: C24.2 C55.2 U4.1(OUT) U23.21(VREF+)
RESET: C77.2 JP1.15(RESET#) R122.1 U23.14(NRST)
RS485_CON_1: U23.70(PA11/USART1_CTS/CANRX/TIM1_CH4/USBDM)
RS485_CON_2: U23.88(PD7)
SCL: U23.92(PB6/I2C1_SCL/TIM4_CH1)
SDA: U23.93(PB7/I2C1_SDA/TIM4_CH2)
SPI2_MISO: U7.2(DO) U23.53(PB14/SPI2_MISO/USART3_RTS/TIM1_CH2N)
SPI2_MOSI: U7.5(DIO) U23.54(PB15/SPI2_MOSI/TIM1_CH3N)
SPI2_NSS: U23.51(PB12/SPI2_NSS/I2C2_SMBAL/USART3_CK/TIM1_BKIN)
SPI2_SCK: U7.6(C) U23.52(PB13/SPI2_SCK/USART3_CTS/TIM1_CH1N)
STM_RX1: U23.69(PA10/USART1_RX/TIM1_CH3)
STM_RX2: U23.87(PD6)
STM_RX3: U23.48(PB11/I2C2_SDA/USART3_RX)
STM_RX4: R126.1 U23.79(PC11)
STM_TX1: U23.68(PA9/USART1_TX/TIM1_CH2)
STM_TX2: U23.86(PD5)
STM_TX3: U23.47(PB10/I2C2_SCL/USART3_TX)
STM_TX4: R125.1 U23.78(PC10)
W25X16_CS: U7.1(~{S}) U23.33(ADC12_IN14/PC4)
NetC78_2: C78.2 U23.12(OSC_IN) Y2.2(OSC2)
NetC79_2: C79.2 U23.13(OSC_OUT) Y2.1(OSC1)
NetD26_2: D26.2(K) R121.2
NetP16_1: P16.1 R125.2
NetP16_2: P16.2 R126.2
NetR116_2: R116.2 U23.37(PB2/BOOT1)
NetR121_1: R121.1 U23.96(PB9/TIM4_CH4)
NetR124_2: R124.2 U23.94(BOOT0)

Not connected (* = marked no-connect by the designer): JP1 11(JRTCK) 17(JDBGRO) 19(JDBGACK); U23 1(TRACECK/PE2) 2(TRACED0/PE3) 3(TRACED1/PE4) 4(TRACED2/PE5) 5(TRACED3/PE6) 7(PC13-TAMPER-RTC) 8(PC14-OSC32_IN) 9(PC15-OSC32_OUT) 18(ADC12_IN13/PC3) 32(PA7/SPI1_MOSI/ADC12_IN7/TIM3_CH2) 34(ADC12_IN15/PC5) 35(PB0/ADC_IN8/TIM3_CH3) 36(PB1/ADC_IN9/TIM3_CH4) 38(PE7) 43(PE12) 44(PE13) 45(PE14) 46(PE15) 60(PD13) 61(PD14) 62(PD15) 64(PC7) 65(PC8) 66(PC9) 71(PA12/USART1_RTS/CANTX/TIM1_ETR/USBDP) 73(NC) 80(PC12) 85(PD4) 95(PB8/TIM4_CH3) 97(TIM4_ETR/PE0) 98(PE1)

### Notes on the sheet
- (near JP1) JTAG
- (in symbol XTAL) 8M

### Library data of the parts
C22 C23 C76 C77 = Cap_2: Capacitor; Published: 8-Jun-2000; LatestRevisionDate: 17-Jul-2002; LatestRevisionNote: Re-released for DXP Platform.; Publisher: Altium Limited
C24 C55 = Cap: Capacitor; Value: 100nF; Published: 8-Jun-2000; LatestRevisionDate: 17-Jul-2002; LatestRevisionNote: Re-released for DXP Platform.; PackageReference: RAD-0.3; Publisher: Altium Limited
C75 = Cap Pol2: Polarized Capacitor (Axial); Published: 8-Jun-2000; LatestRevisionDate: 17-Jul-2002; LatestRevisionNote: Re-released for DXP Platform.; PackageReference: POLAR0.8; Publisher: Altium Limited; PackageDescription: Polarized Capacitor; 2 Leads
C78 C79 = Cap: Capacitor; Published: 8-Jun-2000; LatestRevisionDate: 17-Jul-2002; LatestRevisionNote: Re-released for DXP Platform.; PackageReference: RAD-0.3; Publisher: Altium Limited
D26 = SML-P12YTT86: as D17 on sheet MidDin; CompType: LED; PartNumber: SML-P12YTT86; SymbolVersion: 2008-12-08; MountType: SMT; RoHS: Y; PackageReference: Yellow LED; Published: 2008-07-11; Publisher: Texas Instruments; ComponentLink1URL: http://rohmfs.rohm.com/en/products/databook/datasheet/opto/led/chip_mono/sml-p1.pdf; ComponentLink1Description: Datasheet link; LatestRevisionDate: 2013-06-24; LatestRevisionNote: Updated supplier queries; Supplier 1: Digi-Key; Supplier Part Number 1: 511-1595-1-ND; Supplier 2: Mouser; Supplier Part Number 2: 755-SML-P12YTT86; Supplier 3: Farnell; Supplier Part Number 3: 1973107
P16 = Header 3: Header, 3-Pin; LatestRevisionDate: 17-Jul-2002; LatestRevisionNote: Re-released for DXP Platform.; Publisher: Altium Limited
R71 R101 R117-R123 = Res Semi: Semiconductor Resistor; Published: 8-Jun-2000; LatestRevisionDate: 17-Jul-2002; LatestRevisionNote: Re-released for DXP Platform.; PackageReference: AXIAL-0.5; Publisher: Altium Limited
  R122: Value: 10K
R116 = RES
R124 = RES: Value: 10K
R125 R126 = Res1: Resistor; Published: 8-Jun-2000; LatestRevisionDate: 17-Jul-2002; LatestRevisionNote: Re-released for DXP Platform.; PackageReference: AXIAL-0.3; Publisher: Altium Limited
U4 = REF3012
U7 = A25L080
U23 = STM32F103VBT6: STM32 ARM-based 32-bit MCU with 64 Kbytes Flash, 100-pin LQFP, Industrial Temperature; Published: *; DatasheetVersion: *; PackageVersion: *; PackageReference: *; Publisher: *; PackageDescription: *; ComponentLink1Description: *; ComponentLink1URL: *; ComponentLink2Description: *; ComponentLink2URL: *
Y2 = XTAL: Crystal Oscillator; Published: 8-Jun-2000; LatestRevisionDate: 17-Jul-2002; LatestRevisionNote: Re-released for DXP Platform.; PackageReference: R38; Publisher: Altium Limited

## Sheet MidEthernet.SchDoc
size A4
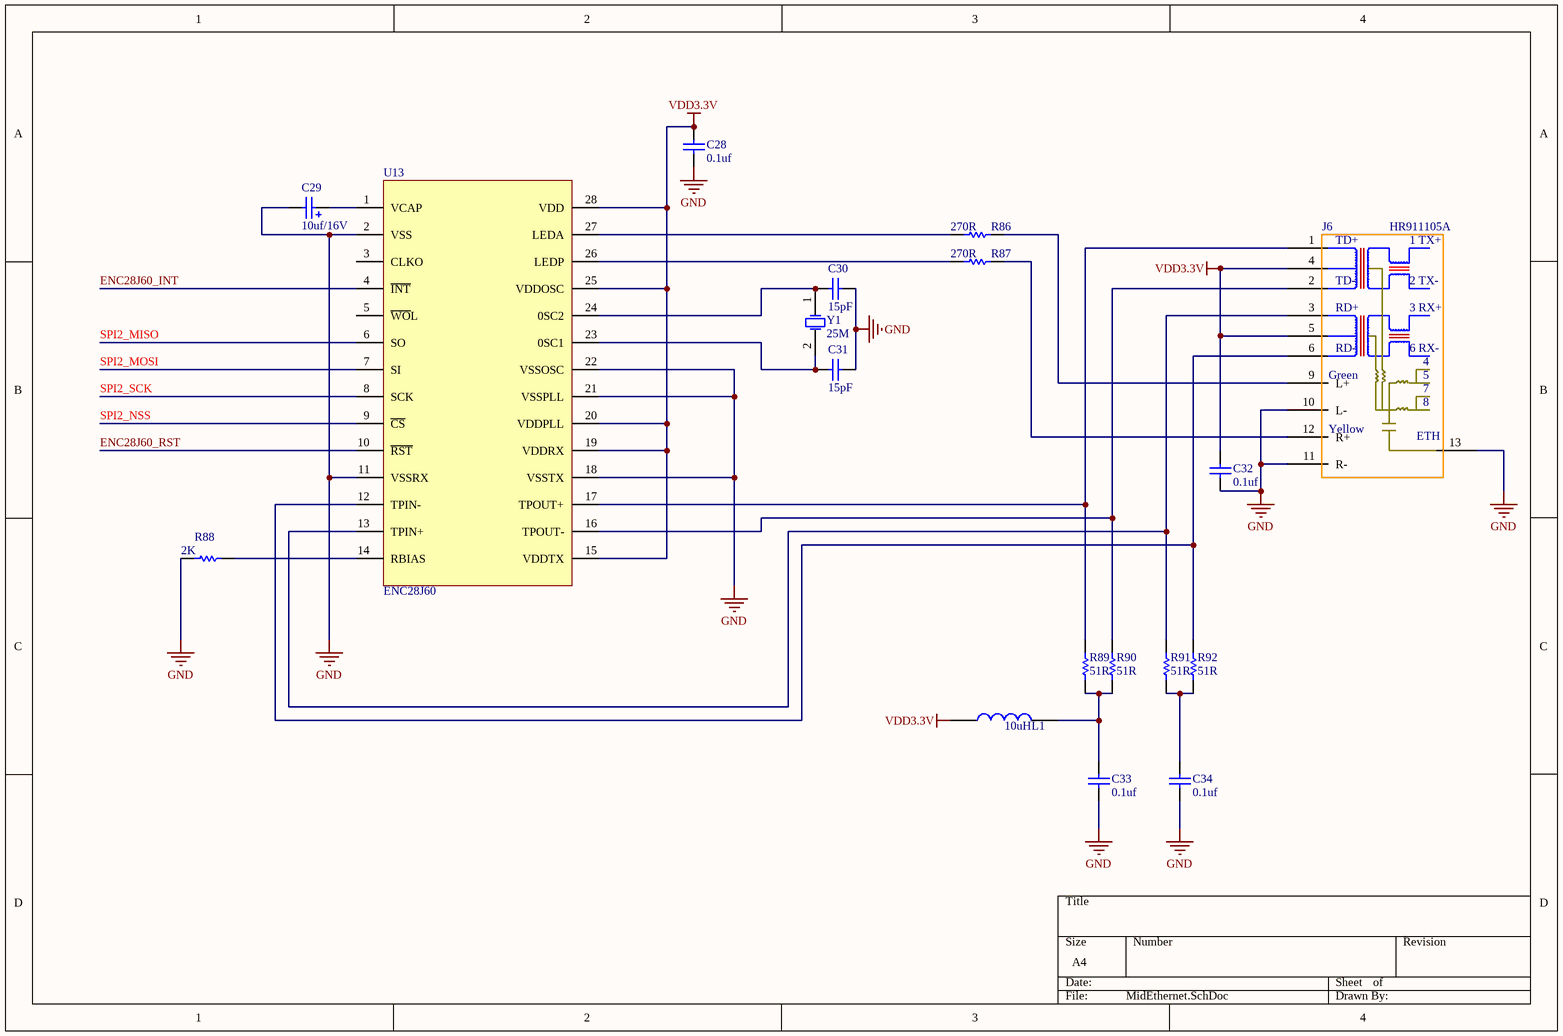
[diagram p7: MidEthernet.SchDoc]

### Parts
C28  value 0.1uf  [C0805]  (hidden comment: Cap)
C29  value 10uf/16V  [C3216]
C30  value 15pF  [C0805]  (hidden comment: Cap)
C31  value 15pF  [C0805]  (hidden comment: Cap)
C32  value 0.1uf  [C0805]  (hidden comment: Cap)
C33  value 0.1uf  [C0805]  (hidden comment: Cap)
C34  value 0.1uf  [C0805]  (hidden comment: Cap)
J6  HR911105A  [HR911105A]
L1  10uH  [INDM4532N]
R86  value 270R  [0805]  (hidden comment: Res Semi)
R87  value 270R  [0805]  (hidden comment: Res Semi)
R88  value 2K  [0805]  (hidden comment: Res Semi)
R89  value 51R  [0805]  (hidden comment: Res Semi)
R90  value 51R  [0805]  (hidden comment: Res Semi)
R91  value 51R  [0805]  (hidden comment: Res Semi)
R92  value 51R  [0805]  (hidden comment: Res Semi)
U13  ENC28J60  [SSOP28]
Y1  XTAL  [CY]  (value not drawn)

### Nets
GND: C28.1 C29.2 C30.1 C31.1 C32.1 C33.1 C34.1 J6.10(L-) J6.11(R-) J6.13 R88.2 U13.2(VSS) U13.11(VSSRX) U13.18(VSSTX) U13.21(VSSPLL) U13.22(VSSOSC)
VDD3.3V: C28.2 C32.2 J6.4 J6.5 L1.1 U13.15(VDDTX) U13.19(VDDRX) U13.20(VDDPLL) U13.25(VDDOSC) U13.28(VDD)
ENC28J60_INT: U13.4(~{INT})
ENC28J60_RST: U13.10(~{RST})
SPI2_MISO: U13.6(SO)
SPI2_MOSI: U13.7(SI)
SPI2_NSS: U13.9(~{CS})
SPI2_SCK: U13.8(SCK)
NetC29_1: C29.1 U13.1(VCAP)
NetC30_2: C30.2 U13.24(0SC2) Y1.1(OSC1)
NetC31_2: C31.2 U13.23(0SC1) Y1.2(OSC2)
NetC33_2: C33.2 L1.2 R89.2 R90.2
NetC34_2: C34.2 R91.2 R92.2
NetJ6_1: J6.1 R89.1 U13.17(TPOUT+)
NetJ6_2: J6.2 R90.1 U13.16(TPOUT-)
NetJ6_3: J6.3 R91.1 U13.13(TPIN+)
NetJ6_6: J6.6 R92.1 U13.12(TPIN-)
NetJ6_9: J6.9(L+) R86.1
NetJ6_12: J6.12(R+) R87.1
NetR86_2: R86.2 U13.27(LEDA)
NetR87_2: R87.2 U13.26(LEDP)
NetR88_1: R88.1 U13.14(RBIAS)

Not connected (* = marked no-connect by the designer): U13 3(CLKO) 5(~{WO}L)

### Notes on the sheet
- (in symbol HR911102) TD+; 1 TX+; TD-; 2 TX-; RD+; 3 RX+; RD-; 6 RX-; Green; 7; 8; Yellow; ETH
- (in symbol XTAL) 25M

### Library data of the parts
C28 C32-C34 = Cap: as C1 on sheet MidAdc; Published: 08/06/2000; Publisher: Altium Hobart Technology Centre; SubClass: Capacitor
C29 = Cap Pol2: Polarized Capacitor (Axial); Published: 8-Jun-2000; LatestRevisionDate: 17-Jul-2002; LatestRevisionNote: Re-released for DXP Platform.; PackageReference: POLAR0.8; Publisher: Altium Limited; PackageDescription: Polarized Capacitor; 2 Leads
C30 C31 = Cap: Capacitor; Published: 8-Jun-2000; LatestRevisionDate: 17-Jul-2002; LatestRevisionNote: Re-released for DXP Platform.; PackageReference: RAD-0.3; Publisher: Altium Limited
J6 = HR911102
L1 = INDUCTOR
R86-R92 = Res Semi: Semiconductor Resistor; Published: 8-Jun-2000; LatestRevisionDate: 17-Jul-2002; LatestRevisionNote: Re-released for DXP Platform.; PackageReference: AXIAL-0.5; Publisher: Altium Limited
Y1 = XTAL: Crystal Oscillator; Published: 8-Jun-2000; LatestRevisionDate: 17-Jul-2002; LatestRevisionNote: Re-released for DXP Platform.; PackageReference: R38; Publisher: Altium Limited

## Sheet MidPwm.SchDoc
size A4
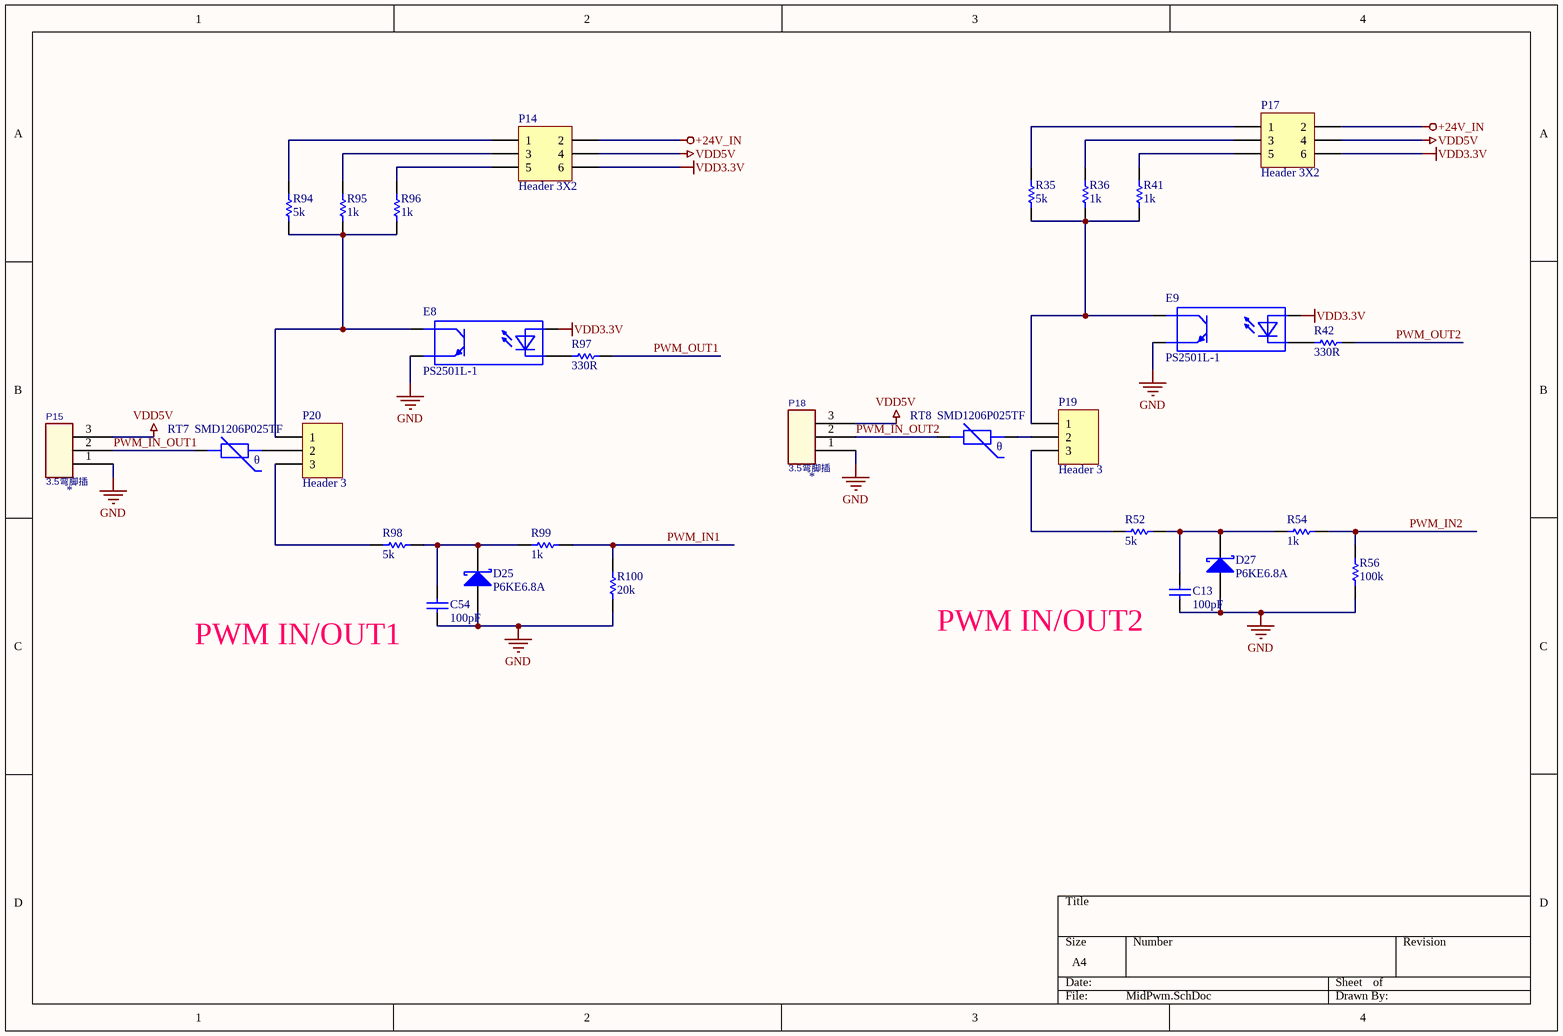
[diagram p8: MidPwm.SchDoc]

### Parts
C13  value 100pF  [C0805]  (hidden comment: Cap)
C54  value 100pF  [C0805]  (hidden comment: Cap)
D25  P6KE6.8A  [SMB]
D27  P6KE6.8A  [SMB]
E8  PS2501L-1  [NEC2501]
E9  PS2501L-1  [NEC2501]
P14  Header 3X2  [HDR2X3]
P15  *  [3.5-P3]
P17  Header 3X2  [HDR2X3]
P18  *  [3.5-P3]
P19  Header 3  [HDR1X3]
P20  Header 3  [HDR1X3]
R35  value 5k  [0805]  (hidden comment: Res Semi)
R36  value 1k  [0805]  (hidden comment: Res Semi)
R41  value 1k  [0805]  (hidden comment: Res Semi)
R42  value 330R  [0805]  (hidden comment: Res Semi)
R52  value 5k  [0805]  (hidden comment: Res Semi)
R54  value 1k  [0805]  (hidden comment: Res Semi)
R56  value 100k  [0805]  (hidden comment: Res Semi)
R94  value 5k  [0805]  (hidden comment: Res Semi)
R95  value 1k  [0805]  (hidden comment: Res Semi)
R96  value 1k  [0805]  (hidden comment: Res Semi)
R97  value 330R  [0805]  (hidden comment: Res Semi)
R98  value 5k  [0805]  (hidden comment: Res Semi)
R99  value 1k  [0805]  (hidden comment: Res Semi)
R100  value 20k  [0805]  (hidden comment: Res Semi)
RT7  SMD1206P025TF  [1206]
RT8  SMD1206P025TF  [1206]

### Nets
+24V_IN: P14.2 P17.2
GND: C13.2 C54.2 D25.1(A) D27.1(A) E8.3 E9.3 P15.1 P18.1 R56.2 R100.2
VDD3.3V: E8.1 E9.1 P14.6 P17.6
VDD5V: P14.4 P15.3 P17.4 P18.3
PWM_IN1: R99.2 R100.1
PWM_IN2: R54.2 R56.1
PWM_IN_OUT1: P15.2 RT7.1
PWM_IN_OUT2: P18.2 RT8.1
PWM_OUT1: R97.2
PWM_OUT2: R42.2
NetC13_1: C13.1 D27.2(K) R52.2 R54.1
NetC54_1: C54.1 D25.2(K) R98.2 R99.1
NetE8_2: E8.2 R97.1
NetE8_4: E8.4 P20.1 R94.2 R95.2 R96.2
NetE9_2: E9.2 R42.1
NetE9_4: E9.4 P19.1 R35.2 R36.2 R41.2
NetP14_1: P14.1 R94.1
NetP14_3: P14.3 R95.1
NetP14_5: P14.5 R96.1
NetP17_1: P17.1 R35.1
NetP17_3: P17.3 R36.1
NetP17_5: P17.5 R41.1
NetP19_2: P19.2 RT8.2
NetP19_3: P19.3 R52.1
NetP20_2: P20.2 RT7.2
NetP20_3: P20.3 R98.1

### Notes on the sheet
- PWM IN/OUT1
- PWM IN/OUT2
- (in symbol CON3) 3.5弯脚插
- (in symbol PTC) θ

### Library data of the parts
C13 C54 = Cap: as C1 on sheet MidAdc; Published: 08/06/2000; Publisher: Altium Hobart Technology Centre; SubClass: Capacitor
D25 D27 = D Schottky: Schottky Diode; Published: 8-Jun-2000; LatestRevisionDate: 17-Jul-2002; LatestRevisionNote: Re-released for DXP Platform.; PackageReference: SMB; Publisher: Altium Limited; Code_JEDEC: DO-214-AA
E8 E9 = OPT: 光耦
P14 P17 = Header 3X2: Header, 3-Pin, Dual row; LatestRevisionDate: 17-Jul-2002; LatestRevisionNote: Re-released for DXP Platform.; Publisher: Altium Limited
P15 P18 = CON3: PCB Footprint SM: 插件; TOLERANCE: =J57_TOLERANCE
P19 P20 = Header 3: Header, 3-Pin; LatestRevisionDate: 17-Jul-2002; LatestRevisionNote: Re-released for DXP Platform.; Publisher: Altium Limited
R35 R36 R41 R42 R52 R54 R56 R94-R100 = Res Semi: Semiconductor Resistor; Published: 8-Jun-2000; LatestRevisionDate: 17-Jul-2002; LatestRevisionNote: Re-released for DXP Platform.; PackageReference: AXIAL-0.5; Publisher: Altium Limited
RT7 RT8 = PTC: 热敏电阻

## Sheet MidWifi.SchDoc
size A4
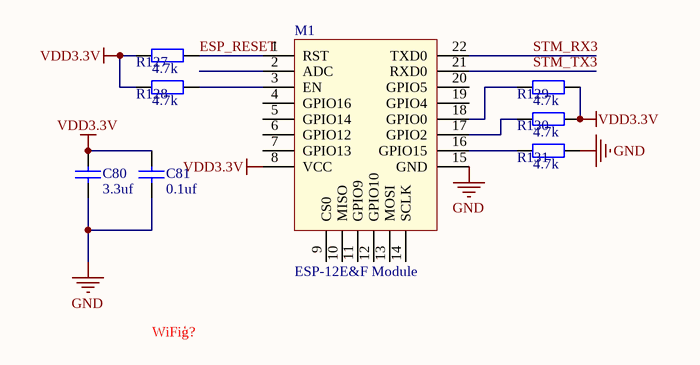
[diagram p9: MidWifi.SchDoc]

### Parts
C80  value 3.3uf  [C0805]  (hidden comment: Cap)
C81  value 0.1uf  [C0805]  (hidden comment: Cap)
M1  ESP-12E&F Module  [ESP-12E&F Module]
R127  value 4.7k  [0805]  (hidden comment: Res2)
R128  value 4.7k  [0805]  (hidden comment: Res2)
R129  value 4.7k  [0805]  (hidden comment: Res2)
R130  value 4.7k  [0805]  (hidden comment: Res2)
R131  value 4.7k  [0805]  (hidden comment: Res2)

### Nets
GND: C80.2 C81.2 M1.15(GND) R131.1
VDD3.3V: C80.1 C81.1 M1.8(VCC) R127.2 R128.2 R129.1 R130.1
ESP_RESET: M1.1(RST) R127.1
STM_RX3: M1.22(TXD0)
STM_TX3: M1.21(RXD0)
NetM1_3: M1.3(EN) R128.1
NetM1_16: M1.16(GPIO15) R131.2
NetM1_17: M1.17(GPIO2) R130.2
NetM1_18: M1.18(GPIO0) R129.2

Not connected (* = marked no-connect by the designer): M1 2(ADC) 4(GPIO16) 5(GPIO14) 6(GPIO12) 7(GPIO13) 9(CS0) 10(MISO) 11(GPIO9) 12(GPIO10) 13(MOSI) 14(SCLK) 19(GPIO4) 20(GPIO5)

### Notes on the sheet
- WiFiģ?

### Library data of the parts
C80 C81 = Cap: as C1 on sheet MidAdc; Published: 08/06/2000; Publisher: Altium Hobart Technology Centre; SubClass: Capacitor
R127-R131 = RES

## Nets that join several sheets
+24V_IN: MidDout (5 pins), MidPower (5 pins), MidPwm (P14.2 P17.2)
ASSA: MidAdc (37 pins), MidDac (32 pins), MidPower (10 pins), STM_MCU (8 pins)
GND: Mid485 (E1.3 E10.3), MidDin (8 pins), MidDout (5 pins), MidPower (19 pins), STM_MCU (25 pins), MidEthernet (16 pins), MidPwm (10 pins), MidWifi (C80.2 C81.2 M1.15 R131.1)
GND_485-1: Mid485 (7 pins), MidPower (B1.3 C41.1 C42.1)
GND_485-2: Mid485 (7 pins), MidPower (B3.3 C40.1 C46.1)
VCC5V: MidDac (C19.1 U6.8), MidPower (C49.1 IC2.2 IC2.4)
VCC_485-1: Mid485 (5 pins), MidPower (B1.4 C41.2 C42.2)
VCC_485-2: Mid485 (5 pins), MidPower (B3.4 C40.2 C46.2)
VDD3.3V: Mid485 (6 pins), MidDin (E4.4 E5.4 E6.4 E7.4), MidPower (C38.1 C39.1 IC1.2 IC1.4), STM_MCU (20 pins), MidEthernet (10 pins), MidPwm (E8.1 E9.1 P14.6 P17.6), MidWifi (7 pins)
VDD5V: MidPower (7 pins), MidPwm (P14.4 P15.3 P17.4 P18.3)
AIN1: MidAdc (C10.1 D2.1 R31.2), STM_MCU (U23.24)
AIN2: MidAdc (C16.1 D2.2 R38.2), STM_MCU (U23.25)
AIN3: MidAdc (C11.1 D3.1 R32.2), STM_MCU (U23.26)
AIN4: MidAdc (C17.1 D3.2 R39.2), STM_MCU (U23.29)
AIN5: MidAdc (C7.1 D1.1 R30.2), STM_MCU (U23.30)
AIN6: MidAdc (C15.1 D1.2 R33.2), STM_MCU (U23.31)
AVCC+12V: MidAdc (5 pins), MidDac (12 pins), MidPower (5 pins)
AVCC-12V: MidAdc (5 pins), MidDac (U17.4 U18.4), MidPower (C43.2 L3.1)
DAC_Din: MidDac (U6.7), STM_MCU (U23.83)
DAC_Sclk: MidDac (U6.6), STM_MCU (U23.82)
DAC_SYNC: MidDac (U6.9), STM_MCU (U23.81)
DO0: MidDout (U12.8), STM_MCU (U23.55)
DO1: MidDout (U12.7), STM_MCU (U23.56)
DO2: MidDout (U12.6), STM_MCU (U23.57)
DO3: MidDout (U12.5), STM_MCU (U23.58)
DSI0: MidDin (E4.3 R75.1 R76.1), STM_MCU (U23.39)
DSI1: MidDin (E5.3 R78.1 R79.1), STM_MCU (U23.40)
DSI2: MidDin (E6.3 R81.1 R82.1), STM_MCU (U23.41)
DSI3: MidDin (E7.3 R84.1 R85.1), STM_MCU (U23.42)
ENC28J60_INT: STM_MCU (U23.17), MidEthernet (U13.4)
ENC28J60_RST: STM_MCU (U23.16), MidEthernet (U13.10)
ESP_RESET: STM_MCU (U23.15), MidWifi (M1.1 R127.1)
PWM_IN1: STM_MCU (U23.23), MidPwm (R99.2 R100.1)
PWM_IN2: STM_MCU (U23.67), MidPwm (R54.2 R56.1)
PWM_OUT1: STM_MCU (U23.63), MidPwm (R97.2)
PWM_OUT2: STM_MCU (U23.59), MidPwm (R42.2)
REF5V: MidDac (5 pins), MidPower (C52.1 U16.6)
RS485_CON_1: Mid485 (E2.2), STM_MCU (U23.70)
RS485_CON_2: Mid485 (E11.2), STM_MCU (U23.88)
SPI2_MISO: STM_MCU (U7.2 U23.53), MidEthernet (U13.6)
SPI2_MOSI: STM_MCU (U7.5 U23.54), MidEthernet (U13.7)
SPI2_NSS: STM_MCU (U23.51), MidEthernet (U13.9)
SPI2_SCK: STM_MCU (U7.6 U23.52), MidEthernet (U13.8)
STM_RX1: Mid485 (E1.4 R2.1), STM_MCU (U23.69)
STM_RX2: Mid485 (E10.4 R37.1), STM_MCU (U23.87)
STM_RX3: STM_MCU (U23.48), MidWifi (M1.22)
STM_TX1: Mid485 (E3.2), STM_MCU (U23.68)
STM_TX2: Mid485 (E12.2), STM_MCU (U23.86)
STM_TX3: STM_MCU (U23.47), MidWifi (M1.21)